# Altium project TRIQC.PrjPcb
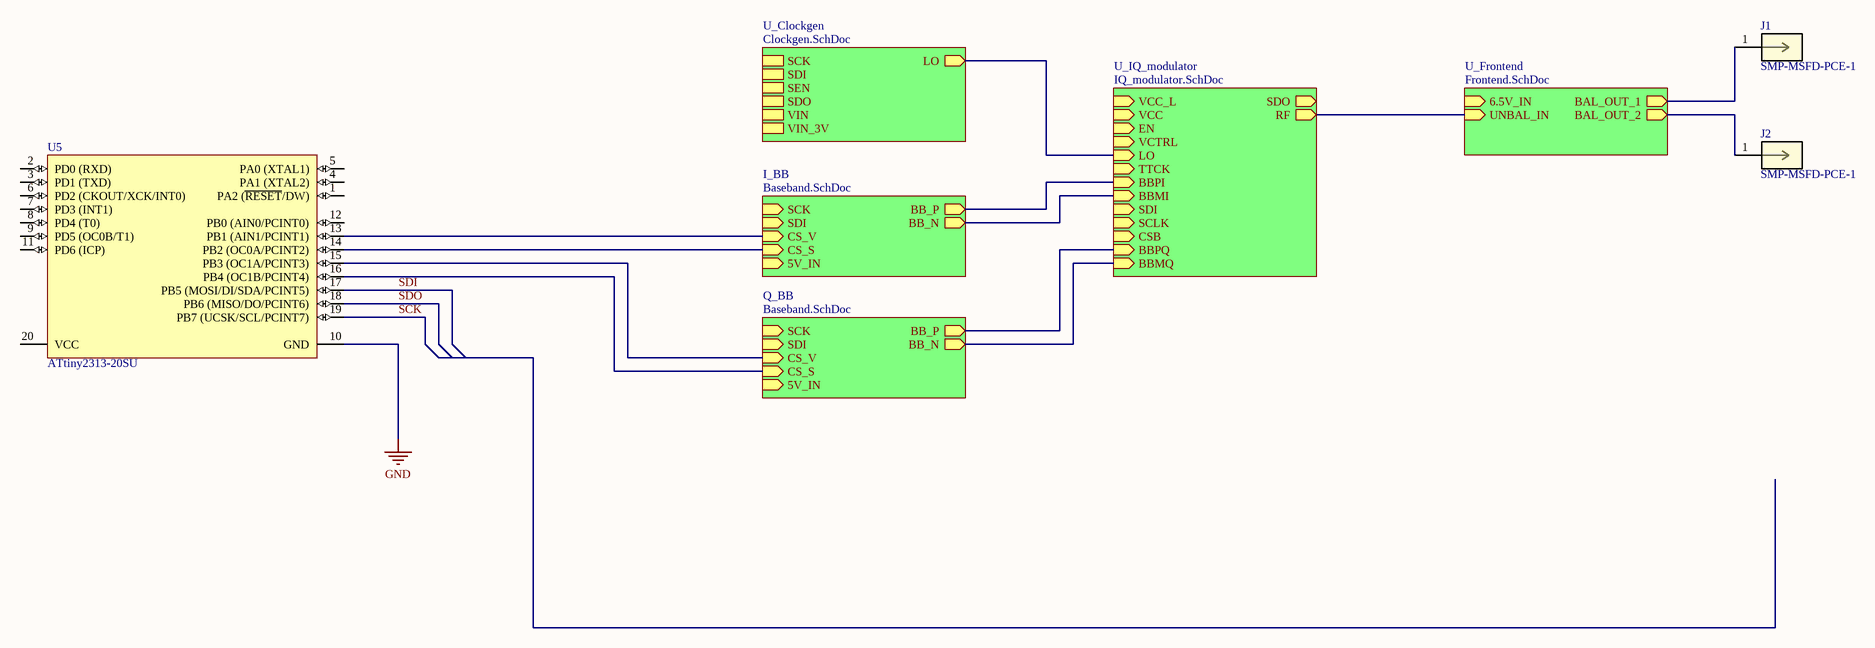
[diagram p0: Top_level.SchDoc]
5 sheets, 146 parts. Net scope: hierarchical (ports join the sheet entries above them; power ports are global).
Board file: TRIQC.PcbDoc
Sheets:
  Top_level.SchDoc
    U_Frontend = Frontend.SchDoc
    I_BB = Baseband.SchDoc
    Q_BB = Baseband.SchDoc
    U_Clockgen = Clockgen.SchDoc
    U_IQ_modulator = IQ_modulator.SchDoc

## Sheet Top_level.SchDoc
size C; SheetNumber: 1; SheetTotal: 5

### Parts
J1  SMP-MSFD-PCE-1  [CONN_SMP-MSFD-PCE-1_AMP]
J2  SMP-MSFD-PCE-1  [CONN_SMP-MSFD-PCE-1_AMP]
U5  ATtiny2313-20SU  [20S_L]

### Sub-sheets
I_BB = Baseband.SchDoc: SCK (in), SDI (in), CS_V (in), CS_S (in), 5V_IN (in), BB_P (out), BB_N (out)
Q_BB = Baseband.SchDoc: SCK (in), SDI (in), CS_V (in), CS_S (in), 5V_IN (in), BB_P (out), BB_N (out)
U_Clockgen = Clockgen.SchDoc: LO (out), SCK, SDI, SEN, SDO, VIN, VIN_3V
U_Frontend = Frontend.SchDoc: 6.5V_IN (in), BAL_OUT_1 (out), BAL_OUT_2 (out), UNBAL_IN (in)
U_IQ_modulator = IQ_modulator.SchDoc: VCC_L (in), VCC (in), EN (in), VCTRL (in), LO (in), TTCK (in), BBPI (in), BBMI (in), SDO (out), SDI (in), SCLK (in), CSB (in), RF (out), BBMQ (in), BBPQ (in)

### Nets
GND: U5.10(GND)
SCK: U5.19(PB7_(UCSK/SCL/PCINT7))
SDI: U5.17(PB5_(MOSI/DI/SDA/PCINT5))
SDO: U5.18(PB6_(MISO/DO/PCINT6))
NetC17_I_BB_1: sheet I_BB/BB_P, sheet U_IQ_modulator/BBPI
NetC17_I_BB_2: sheet I_BB/BB_N, sheet U_IQ_modulator/BBMI
NetC17_Q_BB_1: sheet Q_BB/BB_P, sheet U_IQ_modulator/BBPQ
NetC17_Q_BB_2: sheet Q_BB/BB_N, sheet U_IQ_modulator/BBMQ
NetC31_1: sheet U_Frontend/UNBAL_IN, sheet U_IQ_modulator/RF
NetC35_2: sheet U_Clockgen/LO, sheet U_IQ_modulator/LO
NetJ1_1: J1.1 ; sheet U_Frontend/BAL_OUT_1
NetJ2_1: J2.1 ; sheet U_Frontend/BAL_OUT_2
NetU5_13: U5.13(PB1_(AIN1/PCINT1)) ; sheet I_BB/CS_V
NetU5_14: U5.14(PB2_(OC0A/PCINT2)) ; sheet I_BB/CS_S
NetU5_15: U5.15(PB3_(OC1A/PCINT3)) ; sheet Q_BB/CS_V
NetU5_16: U5.16(PB4_(OC1B/PCINT4)) ; sheet Q_BB/CS_S

Not connected (* = marked no-connect by the designer): U5 1(PA2_(~{RESET}/DW)) 2(PD0_(RXD)) 3(PD1_(TXD)) 4(PA1_(XTAL2)) 5(PA0_(XTAL1)) 6(PD2_(CKOUT/XCK/INT0)) 7(PD3_(INT1)) 8(PD4_(T0)) 9(PD5_(OC0B/T1)) 11(PD6_(ICP)) 12(PB0_(AIN0/PCINT0)) 20(VCC)

### Library data of the parts
J1 J2 = SMP-MSFD-PCE-1: No Description Available; Mfr_Name: Amphenol ICC; Copyright: Copyright (C) 2023 Ultra Librarian. All rights reserved.; Manufacturer_Part_Number: SMP-MSFD-PCE-1; RefDes: RefDes; Type: DEV
U5 = CMP-0093-00143-2: Low Power tinyAVR® 8-Bit Microcontroller, 2.7-5.5V, 20MHz, 2K Flash Memory, Industrial Grade (-40°C to 85°C), 20-Lead SOIC, Pb-Free; DatasheetVersion: revL, Aug-2010; ComponentLink1Description: Manufacturer URL; ComponentLink3Description: ATtiny2313 Summary; Code_JEDEC: MS-013-AC; PackageDescription: 20-lead, 0.300" Wide Body, Plastic Gull Wing Small Outline Package (SOIC); RevisionNote: DatasheetVersion & PackageVersion updated. URLs added.; ComponentLink2URL: http://www.atmel.com/dyn/resources/prod_documents/doc2543.pdf; ComponentLink3URL: http://www.atmel.com/dyn/resources/prod_documents/doc2543S.pdf; Code_IPC: SOIC127P1030-20; ComponentLink2Description: ATtiny2313 Datasheet; PackageReference: 20S; ComponentLink1URL: http://www.atmel.com/; PackageVersion: revB, Nov-2006

## Sheet Frontend.SchDoc
size C; SheetNumber: 4; SheetTotal: 5
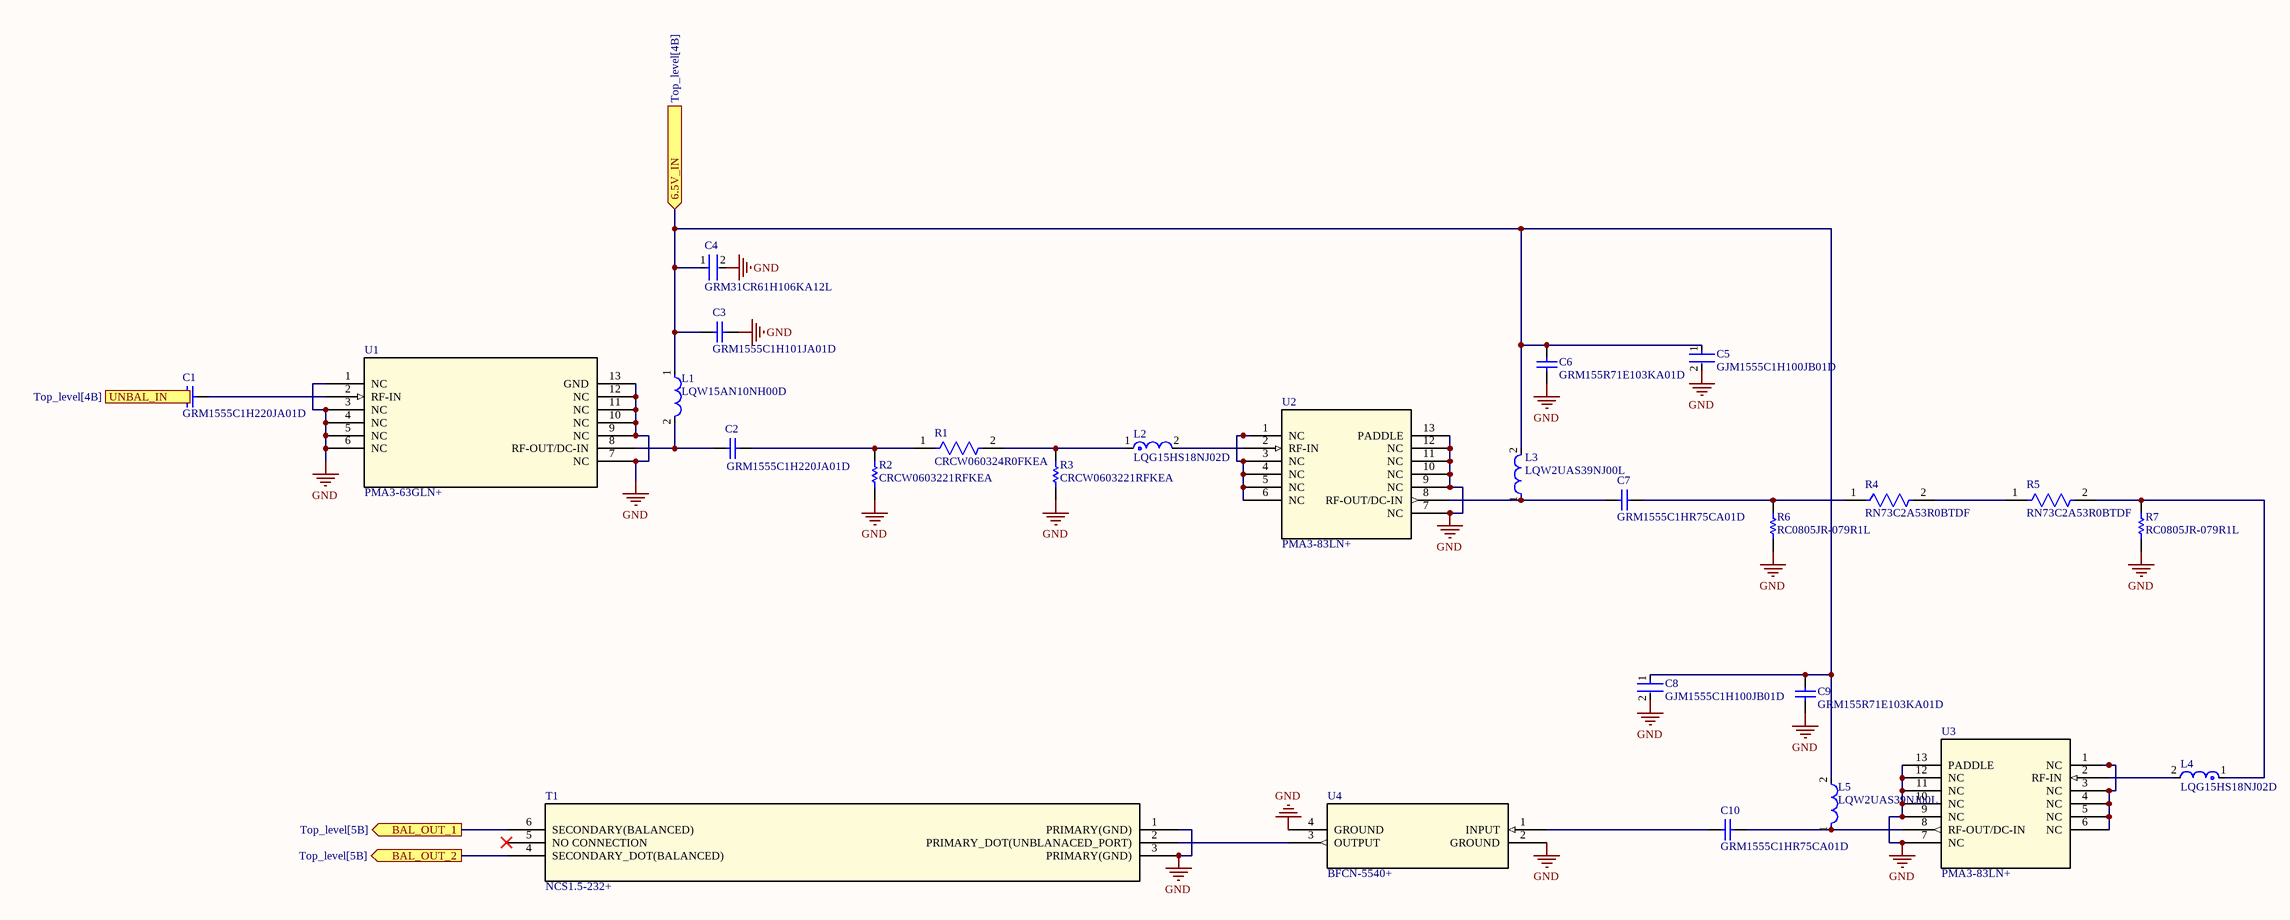
[diagram p1: Frontend.SchDoc]

### Parts
C1  GRM1555C1H220JA01D  [CAPC1005X55X25NL05T10]
C2  GRM1555C1H220JA01D  [CAPC1005X55X25NL05T10]
C3  GRM1555C1H101JA01D  [CAPC1005X55X25ML05T10]
C4  GRM31CR61H106KA12L  [FP-GRM31-0_2-MFG]
C5  GJM1555C1H100JB01D  [FP-GJM155-0_05-IPC_A]
C6  GRM155R71E103KA01D  [CAPC1005X55X25LL05T10]
C7  GRM1555C1HR75CA01D  [CAPC1005X55X25LL05T10]
C8  GJM1555C1H100JB01D  [FP-GJM155-0_05-IPC_A]
C9  GRM155R71E103KA01D  [CAPC1005X55X25LL05T10]
C10  GRM1555C1HR75CA01D  [CAPC1005X55X25LL05T10]
L1  LQW15AN10NH00D  [FP-LQW15AN_00-W0_6-0_1-MFG]
L2  LQG15HS18NJ02D  [FP-LQG15HH_02-MFG]
L3  LQW2UAS39NJ00L  [FP-LQW2UAS_00-MFG]
L4  LQG15HS18NJ02D  [FP-LQG15HH_02-MFG]
L5  LQW2UAS39NJ00L  [FP-LQW2UAS_00-MFG]
R1  CRCW060324R0FKEA  [FP-CRCW0603-e3-MFG]
R2  CRCW0603221RFKEA  [RESC1609X50X30LL10T20]
R3  CRCW0603221RFKEA  [RESC1609X50X30LL10T20]
R4  RN73C2A53R0BTDF  [FP-RN732A-MFG]
R5  RN73C2A53R0BTDF  [FP-RN732A-MFG]
R6  RC0805JR-079R1L  [RESC2013X60X35LL10T20]
R7  RC0805JR-079R1L  [RESC2013X60X35LL10T20]
T1  NCS1.5-232+  [GE0805C-9_MNC]
U1  PMA3-63GLN+  [DQ1225_MNC]
U2  PMA3-83LN+  [DQ1225_MNC]
U3  PMA3-83LN+  [DQ1225_MNC]
U4  BFCN-5540+  [FV1206-4_MNC]

### Ports
6.5V_IN (in, see Top_level[4B]), BAL_OUT_1 (out, see Top_level[5B]), BAL_OUT_2 (out, see Top_level[5B]), UNBAL_IN (in, see Top_level[4B])

### Nets
GND: C3.2 C4.2 C5.2 C6.1 C8.2 C9.1 R2.1 R3.1 R6.1 R7.1 T1.1(PRIMARY(GND)) T1.3(PRIMARY(GND)) U1.1(NC) U1.3(NC) U1.4(NC) U1.5(NC) U1.6(NC) U1.7(NC) U1.9(NC) U1.10(NC) U1.11(NC) U1.12(NC) U1.13(GND) U2.7(NC) U2.9(NC) U2.10(NC) U2.11(NC) U2.12(NC) U2.13(PADDLE) U3.7(NC) U3.9(NC) U3.10(NC) U3.11(NC) U3.12(NC) U3.13(PADDLE) U4.2(GROUND) U4.4(GROUND)
NetC1_1: C1.1 U1.2(RF-IN)
NetC2_1: C2.1 L1.2 U1.8(RF-OUT/DC-IN)
NetC2_2: C2.2 R1.1 R2.2
NetC3_1: C3.1 C4.1 C5.1 C6.2 C8.1 C9.2 L1.1 L3.2 L5.2 ; port 6.5V_IN
NetC7_1: C7.1 L3.1 U2.8(RF-OUT/DC-IN)
NetC7_2: C7.2 R4.1 R6.2
NetC10_1: C10.1 L5.1 U3.8(RF-OUT/DC-IN)
NetC10_2: C10.2 U4.1(INPUT)
NetJ1_1: T1.6(SECONDARY(BALANCED)) ; port BAL_OUT_1
NetJ2_1: T1.4(SECONDARY_DOT(BALANCED)) ; port BAL_OUT_2
NetL2_1: L2.1 R1.2 R3.2
NetL2_2: L2.2 U2.2(RF-IN)
NetL4_1: L4.1 R5.2 R7.2
NetL4_2: L4.2 U3.2(RF-IN)
NetR4_2: R4.2 R5.1
NetT1_2: T1.2(PRIMARY_DOT(UNBLANACED_PORT)) U4.3(OUTPUT)
NetU2_1: U2.1(NC) U2.3(NC) U2.4(NC) U2.5(NC) U2.6(NC)
NetU3_1: U3.1(NC) U3.3(NC) U3.4(NC) U3.5(NC) U3.6(NC)

Not connected (* = marked no-connect by the designer): C1 2; T1 5(NO_CONNECTION)*

### Library data of the parts
C1 C2 = CMP-2008-04302-1: Manufacturer: Murata; Part Number: GRM1555C1H220JA01D
C3 = CMP-2008-03915-1: Manufacturer: Murata; Part Number: GRM1555C1H101JA01D
C4 = CMP-2000-05256-2: CAP CER 10UF 50V X5R 1206; Manufacturer: Murata Electronics North America; Tolerance: 10%; Temperature Coefficient: 15%; Material: Ceramic; Height: 1.8mm; Temperature: -55°C to +85°C; Lead Free: Yes; Temperature Characteristic: X5R; ComponentLink2Description: Datasheet; Digikey Description: CAP CER 10UF 50V X5R 1206; Octopart: https://octopart.com/grm31cr61h106ka12l-murata-18903335; Device Class L2: Capacitors; Automotive: No; Value: 10uF; Temperature Range High: +85°C; Temperature Range Low: -55°C; Device Class L3: Ceramic Capacitors; Voltage Rating: 50V; Capacitance: 10uF; Device Class L1: Passive Components; Mouser Description: Multilayer Ceramic Capacitors MLCC - SMD/SMT 1206 10uF 50volt X5R +/-10%; ComponentLink2URL: https://search.murata.co.jp/Ceramy/image/img/A01X/G101/ENG/GRM31CR61H106KA12-01A.pdf; Manufacturer Part Number: GRM31CR61H106KA12L; Package: GRM31-0.2; RoHS: TRUE; Category: Cap
C5 C8 = CMP-2008-03797-2: Multi-Layer Ceramic Capacitor 10pF C0G  ±5% 0402 Paper T/R; Voltage Rating (DC): 50V; Mount: Surface Mount; Width: 0.02inch; Height: 0.5mm; Termination: SMD/SMT; Capacitance: 10pF; Packaging: Tape and Reel; Case Code (Metric): 1005; Depth: 0.5mm; Min Operating Temperature: -55°C; Case/Package: 0402; Voltage Rating: 50V; Tolerance: 5%; Lead Free: Lead Free; Package Quantity: 1; Case Code (Imperial): 0402; Radiation Hardening: No; Length: 1mm; Voltage: 50V; Dielectric: C0G; Thickness: 0.022inch; Max Operating Temperature: 125°C
C6 C9 = CMP-1034-01880-2: Manufacturer: Murata; Part Number: GRM155R71E103KA01D
C7 C10 = CMP-2008-04480-1: Manufacturer: Murata; Part Number: GRM1555C1HR75CA01D
L1 = CMP-06042-000413-1: Wire Wound RF Inductor 10nH ±3% 500mA 0.17Ω 0402 (1005); Q Factor: 25; Core Material: Non-Magnetic; Test Frequency: 100MHz; DC Resistance (DCR): 170mR; Self Resonant Frequency: 5.5GHz; Shielding: Unshielded; Current: 370mA; Inductance: 10nH; Case Code (Imperial): 0402; Package Quantity: 10000; Height: 0.5mm; Width: 0.02inch; Case Code (Metric): 1005; Tolerance: 3%; Min Operating Temperature: -55°C; Packaging: Tape and Reel; Length: 1mm; DC Current: 500mA; Current Rating: 500mA; Military Standard: Not; Max DC Current: 500mA; Case/Package: 0402; Lead Free: Lead Free; Radiation Hardening: No; Weight: 2.8E-05oz; Height - Seated (Max): 0.024inch; Depth: 0.7mm; Termination: SMD/SMT; Resistor Type: Wirewound; Max Operating Temperature: 125°C; Mount: Surface Mount
L2 L4 = CMP-06042-000668-1: Multilayer type RF Inductor 18nH ±5% 0.36Ω 400mA 0402; DC Current: 300mA; Test Frequency: 100MHz; Self Resonant Frequency: 2.2GHz; Shielding: Unshielded; Core Material: Air; DC Resistance (DCR): 360mR; Q Factor: 8; Inductance: 18nH; Military Standard: Not; REACH SVHC: No SVHC; Tolerance: 5%; Inductance Tolerance: 5%; Weight: 2.3E-05oz; Lead Free: Lead Free; Depth: 0.55mm; Current Rating: 300mA; Max DC Current: 300mA; Max Operating Temperature: 125°C; Length: 0.039inch; Min Operating Temperature: -55°C; Width: 0.5mm; Radiation Hardening: No; Termination: SMD/SMT; Height: 0.5mm; Package Quantity: 10000; Packaging: Tape and Reel; Case/Package: 0402; Case Code (Imperial): 0402; Mount: Surface Mount; Height - Seated (Max): 0.022inch; Case Code (Metric): 1005
L3 L5 = CMP-06042-008950-1: Wire Wound RF Inductor 39nH ±5% 1000mA 0.15Ω 1008 (2520); Q Factor: 60; Test Frequency: 50MHz; Max DC Current: 1A; Self Resonant Frequency: 1.5GHz; DC Resistance (DCR): 150mR; Core Material: Air; Shielding: Unshielded; Package Quantity: 1; Radiation Hardening: No; Weight: 0.001376oz; Case Code (Metric): 2520; Max Operating Temperature: 125°C; Case Code (Imperial): 1008; Inductance Tolerance: 5%; Current Rating: 1A; Resistor Type: Wirewound; Inductance: 39nH; Mount: Surface Mount; Width: 0.096inch; Min Operating Temperature: -55°C; Packaging: Tape and Reel; Length: 0.103inch; Case/Package: 1008; Termination: SMD/SMT; Height: 1.83mm; REACH SVHC: No SVHC; Depth: 2.65mm; Height - Seated (Max): 0.08inch; Tolerance: 5%
R1 = CMP-2000-03123-2: RES Thick Film, 24Ω, 1%, 0.1W, 100ppm/°C, 0603; Voltage Rating (DC): 75V; Power Rating: 100mW; Resistance: 24R; Case/Package: 0603; Composition: Thick Film; Temperature Coefficient: 100ppm/°C; Length: 1.55mm; Military Standard: Not; Tolerance: 1%; Height: 0.45mm; Width: 0.033inch; Case Code (Imperial): 0603; Weight: 7.1E-05oz; Depth: 0.85mm; Radiation Hardening: No; Packaging: Tape and Reel; Number of Terminations: 2; Case Code (Metric): 1608; Termination: SMD/SMT; Package Quantity: 10; Max Power Dissipation: 100mW; Min Operating Temperature: -55°C; Max Operating Temperature: 155°C; Contact Plating: Tin; Number of Pins: 2; Voltage Rating: 75V; Lead Free: Lead Free; Features: Automotive AEC-Q200
R2 R3 = CMP-2000-03090-1: Manufacturer: Vishay Dale; Part Number: CRCW0603221RFKEA
R4 R5 = CMP-03211-003837-1: SMD Chip Resistor, Thin Film, 53.0Ω, 100 V, 0805 [2012 Metric], 100 mW, 0.1%, RN73 Series; Manufacturer: TE Connectivity; Power Rating: 0.1W; Temperature Coefficient: 10ppm/°C; Voltage Rating: 100V; Ipc Land Pattern Name: RESC200125X55; Device Class L2: Resistors; Lead Free: Yes; Octopart: https://octopart.com/rn73c2a53r0btdf-te+connectivity-22742106; Resistance: 53.0Ω; Temperature: -55°C to 155°C; Package: RN732A; Height: 0.65mm; Temperature Range Low: -55°C; Device Class L3: Chip SMD Resistors; octopart_url: https://octopart.com/rn73c2a53r0btdf-te+connectivity-22742106; Automotive: No; RoHS: TRUE; Device Class L1: Passive Components; packaging: 1000 Reel; Value: 53.0Ω; ComponentLink2URL: https://www.te.com/commerce/DocumentDelivery/DDEController?Action=showdoc&DocId=Data+Sheet%7F1773270%7FP%7Fpdf%7FEnglish%7FENG_DS_1773270_P.pdf%7F1676162-2; ComponentLink2Description: Datasheet; Series: RN73; Manufacturer Part Number: RN73C2A53R0BTDF; Temperature Range High: 155°C; Category: Res; Composition: Thin Film; Tolerance: 0.1%
R6 R7 = CMP-2001-01410-1: Manufacturer: Yageo; Part Number: RC0805JR-079R1L
T1 = NCS1.5-232+: No Description Available; Mfr_Name: Mini Circuits; Type: DEV; Copyright: Copyright (C) 2023 Ultra Librarian. All rights reserved.; Manufacturer_Part_Number: NCS1.5-232+; RefDes: RefDes
U1 = PMA3-63GLN+: No Description Available; Mfr_Name: Mini Circuits; Copyright: Copyright (C) 2023 Ultra Librarian. All rights reserved.; Manufacturer_Part_Number: PMA3-63GLN+; RefDes: RefDes; Type: DEV
U2 U3 = PMA3-83LN+: No Description Available; Mfr_Name: Mini Circuits; Copyright: Copyright (C) 2023 Ultra Librarian. All rights reserved.; Manufacturer_Part_Number: PMA3-83LN+; RefDes: RefDes; Type: DEV
U4 = BFCN-5540+: No Description Available; Mfr_Name: Mini Circuits; Copyright: Copyright (C) 2023 Ultra Librarian. All rights reserved.; Manufacturer_Part_Number: BFCN-5540+; RefDes: RefDes; Type: DEV

## Sheet Baseband.SchDoc
size B; SheetNumber: 2; SheetTotal: 5
Used 2 times, as channels I_BB, Q_BB. Parts and nets are listed once, with the designators drawn on the sheet.
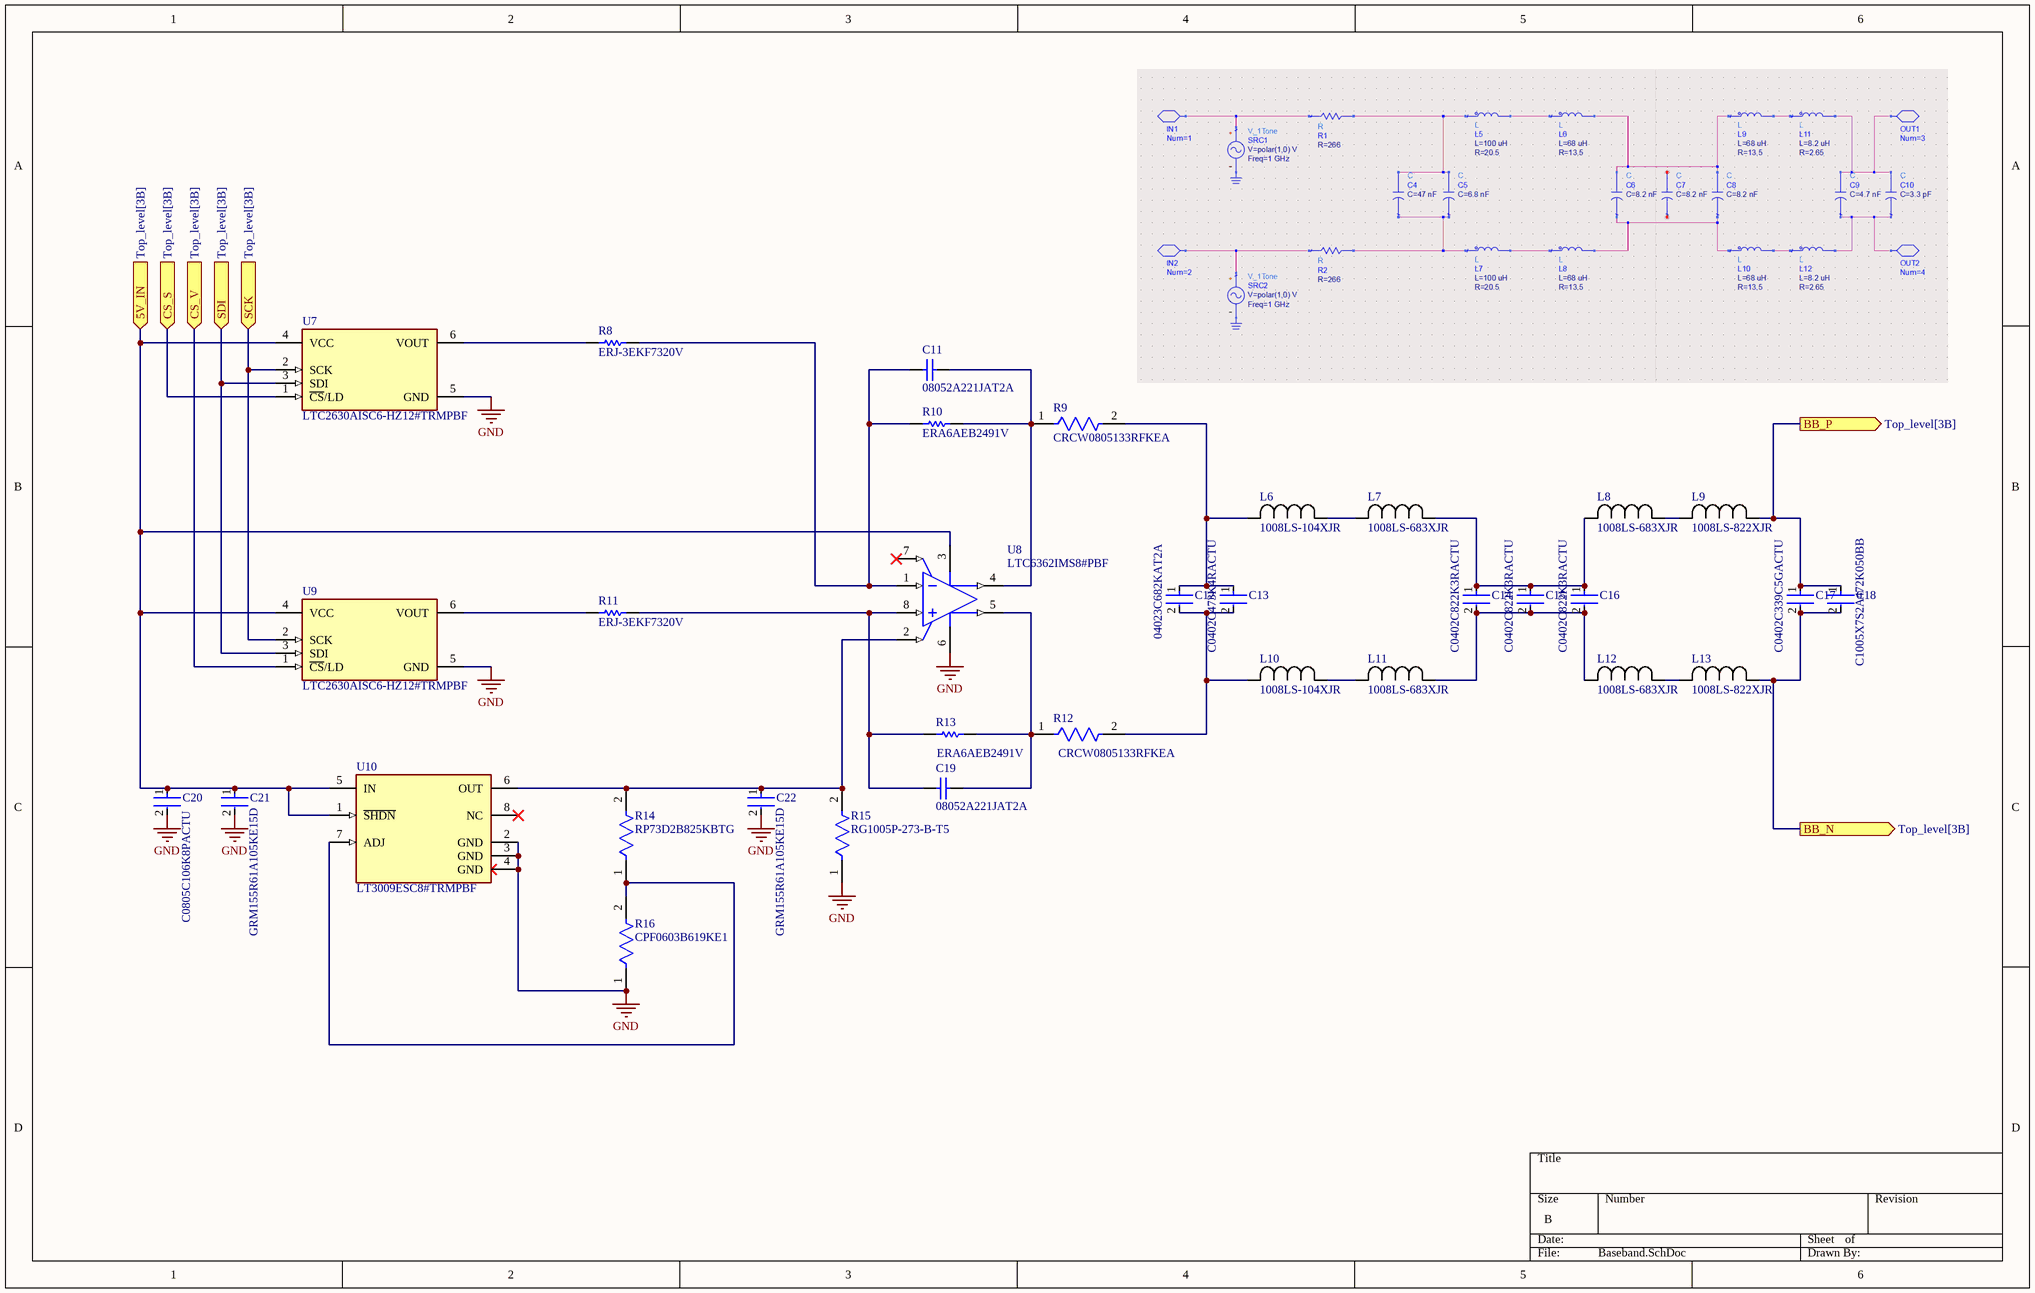
[diagram p2: Baseband.SchDoc]

### Parts
C11  08052A221JAT2A  [CAPC2013X140X50LL20T25]
C12  04023C682KAT2A  [FP-0402-L_1_0_1-W_0_5_0_1-IPC_A]
C13  C0402C473K4RACTU  [FP-C0402-BB-MFG]
C14  C0402C822K3RACTU  [FP-C0402-BB-MFG]
C15  C0402C822K3RACTU  [FP-C0402-BB-MFG]
C16  C0402C822K3RACTU  [FP-C0402-BB-MFG]
C17  C1005X7S2A472K050BB  [FP-C1005-050-0_05-IPC_C]
C18  C0402C339C5GACTU  [FP-C0402-BB-MFG]
C19  08052A221JAT2A  [CAPC2013X140X50LL20T25]
C20  C0805C106K8PACTU  [FP-C0805C-DG-MFG]
C21  GRM155R61A105KE15D  [FP-GRM15-0_1-MFG]
C22  GRM155R61A105KE15D  [FP-GRM15-0_1-MFG]
L6  1008LS-104XJR  [IND_1008LS]
L7  1008LS-683XJR  [IND_1008LS]
L8  1008LS-683XJR  [IND_1008LS]
L9  1008LS-822XJR  [IND_1008LS]
L10  1008LS-104XJR  [IND_1008LS]
L11  1008LS-683XJR  [IND_1008LS]
L12  1008LS-683XJR  [IND_1008LS]
L13  1008LS-822XJR  [IND_1008LS]
R8  ERJ-3EKF7320V  [RESC1608X55X30LL15T15]
R9  CRCW0805133RFKEA  [FP-CRCW0805-e3-IPC_C]
R10  ERA6AEB2491V  [RESC2013X60X40LL20T25]
R11  ERJ-3EKF7320V  [RESC1608X55X30LL15T15]
R12  CRCW0805133RFKEA  [FP-CRCW0805-e3-IPC_C]
R13  ERA6AEB2491V  [RESC2013X60X40LL20T25]
R14  RP73D2B825KBTG  [FP-RP732B-MFG]
R15  RG1005P-273-B-T5  [FP-RG1005-IPC_B]
R16  CPF0603B619KE1  [FP-CPF0603-MFG]
U7  LTC2630AISC6-HZ12#TRMPBF  [FP-SC6-6-05-08-1638-IPC_A]
U8  LTC6362IMS8#PBF  [LT-MS8-8_L]
U9  LTC2630AISC6-HZ12#TRMPBF  [FP-SC6-6-05-08-1638-IPC_A]
U10  LT3009ESC8#TRMPBF  [FP-SC8-8-05-08-1639-MFG]

### Ports
5V_IN (in, see Top_level[3B]), BB_N (out, see Top_level[3B]), BB_P (out, see Top_level[3B]), CS_S (in, see Top_level[3B]), CS_V (in, see Top_level[3B]), SCK (in, see Top_level[3B]), SDI (in, see Top_level[3B])

### Nets
GND: C20.2 C21.2 C22.2 R15.1 R16.1 U7.5(GND) U8.6(V-) U9.5(GND) U10.2(GND) U10.3(GND) U10.4(GND)
5V_IN: C20.1 C21.1 U7.4(VCC) U8.3(V+) U9.4(VCC) U10.1(~{SHDN}) U10.5(IN) ; port 5V_IN
BB_N: C17.2 C18.2 L13.1 ; port BB_N
BB_P: C17.1 C18.1 L9.1 ; port BB_P
CS_S: U7.1(~{CS}/LD) ; port CS_S
CS_V: U9.1(~{CS}/LD) ; port CS_V
SCK: U7.2(SCK) U9.2(SCK) ; port SCK
SDI: U7.3(SDI) U9.3(SDI) ; port SDI
NetC11_1: C11.1 R8.2 R10.1 U8.1(-IN)
NetC11_2: C11.2 R9.1 R10.2 U8.4(+OUT)
NetC12_1: C12.1 C13.1 L6.2 R9.2
NetC12_2: C12.2 C13.2 L10.2 R12.2
NetC14_1: C14.1 C15.1 C16.1 L7.1 L8.2
NetC14_2: C14.2 C15.2 C16.2 L11.1 L12.2
NetC19_1: C19.1 R11.2 R13.1 U8.8(+IN)
NetC19_2: C19.2 R12.1 R13.2 U8.5(-OUT)
NetC22_1: C22.1 R14.2 R15.2 U8.2(VOCM) U10.6(OUT)
NetL6_1: L6.1 L7.2
NetL8_1: L8.1 L9.2
NetL10_1: L10.1 L11.2
NetL12_1: L12.1 L13.2
NetR8_1: R8.1 U7.6(VOUT)
NetR11_1: R11.1 U9.6(VOUT)
NetR14_1: R14.1 R16.2 U10.7(ADJ)

Not connected (* = marked no-connect by the designer): U8 7(~{SHDN})*; U10 8(NC)*

### Channels
I_BB: designators end in _I_BB; ports 5V_IN=NetC20_I_BB_1 BB_N=NetC17_I_BB_2 BB_P=NetC17_I_BB_1 CS_S=NetU5_14 CS_V=NetU5_13 SCK=NetU7_I_BB_2 SDI=NetU7_I_BB_3
Q_BB: designators end in _Q_BB; ports 5V_IN=NetC20_Q_BB_1 BB_N=NetC17_Q_BB_2 BB_P=NetC17_Q_BB_1 CS_S=NetU5_16 CS_V=NetU5_15 SCK=NetU7_Q_BB_2 SDI=NetU7_Q_BB_3

### Library data of the parts
C11 C19 = CMP-2007-04587-1: Manufacturer: AVX Interconnect / Elco; Part Number: 08052A221JAT2A
C12 = CMP-2008-02545-2: General Purpose Ceramic Capacitor, 0402, 6.8nF, 10%, X7R, 15%, 25V; Height: 0.56mm; RoHS Compliant: Yes; Case Code (Metric): 1005; Lead Free: Lead Free; Width: 0.5mm; Weight: 2.3E-05oz; Series: -; Package Quantity: 1; Case Code (Imperial): 0402; Min Operating Temperature: -55°C; Max Operating Temperature: 125°C; Depth: 0.5mm; Tolerance: 10%; Voltage Rating (DC): 25V; Voltage: 25V; Packaging: Tape and Reel; REACH SVHC: No SVHC; Mount: Surface Mount; Case/Package: 0402; Thickness: 0.022inch; Dielectric: X7R; Termination: SMD/SMT; Number of Pins: 2; Construction: Flat; Radiation Hardening: No; Length: 1mm; Capacitance: 6.8nF; Voltage Rating: 25V
C13 = CMP-2008-03221-2: Cap Ceramic 0.047uF 16V X7R 10% SMD 0402 125°C Paper T/R; Manufacturer: Kemet; Tolerance: 0.1; Value: 47,000 pF; Temperature Coefficient: 15%; Material: Ceramic; Mouser Description: Multilayer Ceramic Capacitors MLCC - SMD/SMT 16volts 47000pF X7R 10%; ComponentLink2Description: Datasheet; Temperature Characteristic: X7R; Automotive: No; Package: C0402-BB; Height: 0.55mm; Manufacturer Part Number: C0402C473K4RACTU; Ipc Land Pattern Name: CAPC10050X50; Temperature: -55°C to +125°C; ComponentLink2URL: https://content.kemet.com/datasheets/KEM_C1002_X7R_SMD.pdf; RoHS: TRUE; Capacitance: 47,000 pF; Temperature Range High: +125°C; Digikey Description: Cap Ceramic 0.047uF 16V X7R 10% SMD 0402 125°C Paper T/R; Octopart: https://octopart.com/c0402c473k4ractu-kemet-145703; Lead Free: Yes; Device Class L2: Capacitors; Voltage Rating: 16 V; Temperature Range Low: -55°C; Device Class L1: Passive Components; Category: Cap; Device Class L3: Ceramic Capacitors
C14-C16 = CMP-2008-03260-2: CAP CER 8200PF 25V X7R 0402; Manufacturer: Kemet; Tolerance: 0.1; Capacitance: 8,200 pF; Material: Ceramic; Temperature Coefficient: 15%; Value: 8,200 pF; Lead Free: Yes; Device Class L3: Ceramic Capacitors; Digikey Description: CAP CER 8200PF 25V X7R 0402; Temperature Characteristic: X7R; Automotive: No; Temperature Range Low: -55°C; Manufacturer Part Number: C0402C822K3RACTU; Device Class L2: Capacitors; ComponentLink2Description: Datasheet; Temperature Range High: +125°C; Voltage Rating: 25 V; Device Class L1: Passive Components; Ipc Land Pattern Name: CAPC10050X50; Temperature: -55°C to +125°C; RoHS: TRUE; Package: C0402-BB; ComponentLink2URL: https://content.kemet.com/datasheets/KEM_C1002_X7R_SMD.pdf; Mouser Description: Multilayer Ceramic Capacitors MLCC - SMD/SMT 25volts 8200pF X7R 10%; Category: Cap; Octopart: https://octopart.com/c0402c822k3ractu-kemet-140357; Height: 0.55mm
C17 = CMP-08246-003235-1: Multilayer Ceramic Capacitors 4.7nF ±10% 100V X7S SMD 0402; Case Code (Imperial): 0402; RoHS Compliant: Yes; Capacitance: 4.7nF; Min Operating Temperature: -55°C; Voltage Rating (DC): 100V; Thickness: 0.022inch; Case Code (Metric): 1005; Height: 0.5mm; Tolerance: 10%; Termination: SMD/SMT; Width: 0.02inch; Voltage Rating: 100V; Dielectric: X7S; Case/Package: 0402; Resistor Type: Ceramic; Max Operating Temperature: 125°C; Mount: Surface Mount; Packaging: Tape and Reel; Length: 1mm; Package Quantity: 1; Weight: 2.3E-05oz; Series: C; Lead Free: Lead Free; Depth: 0.5mm
C18 = CMP-2008-03312-2: Capacitor: ceramic; MLCC; 3.3pF; 50VDC; C0G; ±0.25pF; SMD; 0402; Manufacturer: Kemet; Temperature Coefficient: 15%; Voltage Rating: 50 V; RoHS: TRUE; Material: Ceramic; Capacitance: 3.3 pF; Value: 3.3 pF; Height: 0.55mm; Manufacturer Part Number: C0402C339C5GACTU; Temperature: -55°C to +125°C; Package: C0402-BB; Mouser Description: Multilayer Ceramic Capacitors MLCC - SMD/SMT 50volts 3.3pF C0G .25pF; Category: Cap; ComponentLink2Description: Datasheet; Device Class L1: Passive Components; Tolerance: 0.25 pF; Temperature Characteristic: C0G; ComponentLink2URL: https://content.kemet.com/datasheets/KEM_C1002_X7R_SMD.pdf; Device Class L2: Capacitors; Temperature Range High: +125°C; Digikey Description: Capacitor: ceramic; MLCC; 3.3pF; 50VDC; C0G; ±0.25pF; SMD; 0402; Lead Free: Yes; Ipc Land Pattern Name: CAPC10050X50; Octopart: https://octopart.com/c0402c339c5gactu-kemet-105751; Automotive: No; Device Class L3: Ceramic Capacitors; Temperature Range Low: -55°C
C20 = CMP-2007-03243-2: CAP CER 10UF 10V X5R 0805; Manufacturer: Kemet; 3DS Part Number: 220-00001; Tolerance: 10%; Temperature Coefficient: 15%; Material: Ceramic; Device Class L2: Capacitors; Device Class L1: Passive Components; ComponentLink2URL: https://content.kemet.com/datasheets/KEM_C1006_X5R_SMD.pdf; Height: 1.4mm; Lead Free: Yes; Manufacturer Part Number: C0805C106K8PACTU; Digikey Description: CAP CER 10UF 10V X5R 0805; Octopart: https://octopart.com/c0805c106k8pactu-kemet-98697; Capacitance: 10uF; Value: 10uF; Temperature Range Low: -55°C; Temperature: -55°C to +85°C; Automotive: No; Mouser Description: CAP CER 10UF 10V X5R 0805; Ipc Land Pattern Name: CAPC200125X125; Temperature Range High: +85°C; Voltage: 10V; RoHS: TRUE; Device Class L3: Ceramic Capacitors; ComponentLink2Description: Datasheet; Voltage Rating: 10V; Package: C0805C-DG; Temperature Characteristic: X5R; Category: Cap
C21 C22 = CMP-2008-04556-2: CAP CER 1UF 10V X5R 0402; Manufacturer: Murata; Material: Ceramic; Tolerance: 10%; Temperature Coefficient: 15%; Octopart: https://octopart.com/grm155r61a105ke15d-murata-197442; Manufacturer Part Number: GRM155R61A105KE15D; Lead Free: Yes; ComponentLink2Description: Datasheet; Temperature: -55°C to +85°C; Temperature Range High: +85°C; Height: 0.55mm; Capacitance: 1uF; Ipc Land Pattern Name: CAPC10050X50; ComponentLink2URL: https://search.murata.co.jp/Ceramy/image/img/A01X/G101/ENG/GRM155R61A105KE15-01A.pdf; Temperature Range Low: -55°C; Device Class L2: Capacitors; Voltage Rating: 10V; RoHS: TRUE; Device Class L1: Passive Components; Device Class L3: Ceramic Capacitors; Temperature Characteristic: X5R; Mouser Description: 0402 1 uF 10 V ±10% Tolerance X5R Surface Mount Multilayer Ceramic Capacitor; Automotive: No; Package: GRM15-0.1; Digikey Description: CAP CER 1UF 10V X5R 0402; Value: 1uF; Category: Cap
L6-L13 = 1008LS-152XJLC: No Description Available; Mfr_Name: Coilcraft; Type: DEV; Copyright: Copyright (C) 2023 Ultra Librarian. All rights reserved.; Manufacturer_Part_Number: 1008LS-152XJLC; RefDes: RefDes
R8 R11 = CMP-2000-00632-1: Manufacturer: Panasonic; Part Number: ERJ-3EKF7320V
R9 R12 = CMP-1013-00410-3: RES Thick Film, 133Ω, 1%, 0.125W, 100ppm/°C, 0805; Voltage Rating: 150V; Max Power Dissipation: 125mW; Resistance: 133R; Width: 0.049inch; Length: 2mm; Termination: SMD/SMT; Package Quantity: 10; Depth: 1.25mm; Height: 0.45mm; Voltage Rating (DC): 150V; Number of Terminations: 2; Temperature Coefficient: 100ppm/°C; Lead Free: Lead Free; Min Operating Temperature: -55°C; Contact Plating: Tin; Features: Automotive AEC-Q200; Packaging: Tape and Reel; Max Operating Temperature: 155°C; Case/Package: 0805; Weight: 0.000194oz; Tolerance: 1%; Radiation Hardening: No; Power Rating: 125mW; Case Code (Metric): 2012; Composition: Thick Film; Case Code (Imperial): 0805
R10 R13 = CMP-2001-00781-1: Manufacturer: Panasonic; Part Number: ERA6AEB2491V
R14 = CMP-03211-008746-1: Res Thin Film 1206 825KΩ 0.1% 0.25W 15ppm/°C Molded SMD; Manufacturer: TE Connectivity; Voltage Rating: 200V; Temperature: -55°C to 155°C; Height: 0.65mm; packaging: 250 cut tape length; Temperature Range Low: -55°C; Package: RP732B; Temperature Range High: 155°C; Temperature Coefficient: 15ppm/°C; ComponentLink2URL: https://www.te.com/commerce/DocumentDelivery/DDEController?Action=showdoc&DocId=Data+Sheet%7F1773272%7FL%7Fpdf%7FEnglish%7FENG_DS_1773272_L.pdf%7F8-1879255-6; Tolerance: 0.1%; Resistance: 825KΩ; Octopart: https://octopart.com/rp73d2b825kbtg-te+connectivity-42012325; Automotive: No; Ipc Land Pattern Name: RESC305155X55; Device Class L2: Resistors; Power Rating: 0.25W; Category: Res; Manufacturer Part Number: RP73D2B825KBTG; octopart_url: https://octopart.com/rp73d2b825kbtg-te+connectivity-42012325; Device Class L1: Passive Components; Composition: Thin Film; RoHS: TRUE; Value: 825KΩ; Device Class L3: Chip SMD Resistors; Lead Free: Yes; ComponentLink2Description: Datasheet; Series: RP73
R15 = CMP-2002-01241-2: Automotive Metal Thin Film Chip Resistor, 0402, 27kΩ, 0.1%, 25ppm/°C, 0.0625W, 75V; Max Power Dissipation: 63mW; Voltage Rating: 25V; Power Rating: 30mW; Resistance: 27kR; Case Code (Imperial): 0402; Resistor Type: Thin Film; Length: 0.039inch; Tolerance: 0.1%; Packaging: Tape and Reel; Resistance Tolerance: 0.1%; Width: 0.02inch; Termination: SMD/SMT; Series: RG; Voltage Rating (DC): 25V; Temperature Coefficient: 25ppm/°C; RoHS Compliant: Yes; Height: 0.016inch; Number of Terminations: 2; Max Operating Temperature: 155°C; Package Quantity: 1; Features: Automotive AEC-Q200; Number of Pins: 2; Case/Package: 0402; Min Operating Temperature: -55°C; Lead Free: Lead Free; Case Code (Metric): 1005
R16 = CMP-03211-010478-1: RES SMD 619KΩ 0.1% 1/16W 0603; Manufacturer: TE Connectivity; Voltage Rating: 50V; Power Rating: 0.063W; Temperature Coefficient: 25ppm/°C; ComponentLink2Description: Datasheet; Category: Res; Temperature: -55°C to +155°C; Height: 0.55mm; octopart_url: https://octopart.com/cpf0603b619ke1-te+connectivity-76349732; Tolerance: 0.1%; Device Class L3: Chip SMD Resistors; Manufacturer Part Number: CPF0603B619KE1; Octopart: https://octopart.com/cpf0603b619ke1-te+connectivity-76349732; Device Class L1: Passive Components; Series: CPF; Temperature Range Low: -55°C; ComponentLink2URL: https://www.te.com/commerce/DocumentDelivery/DDEController?Action=showdoc&DocId=Data+Sheet%7F1773200%7FM%7Fpdf%7FEnglish%7FENG_DS_1773200_M.pdf%7F3-1676481-2; Automotive: No; packaging: 1k Reel; Package: CPF0603; Value: 619KΩ; Device Class L2: Resistors; Lead Free: Yes; Temperature Range High: +155°C; RoHS: TRUE; Ipc Land Pattern Name: RESC15580X45; Composition: Thin Film; Resistance: 619KΩ
U7 U9 = CMP-09082-000043-1: IC DAC 12BIT V-OUT SC70-6; Min Supply Voltage: 4.5V; Interface: SPI; Output Type: Voltage; Integral Nonlinearity (INL): 1LSB; Max Supply Voltage: 5.5V; Resolution: 12b; Number of Bits: 12; Operating Supply Voltage: 5V; Supply Type: Single; Number of Channels: 1; Settling Time: 4.4us; Min Operating Temperature: -40°C; Case/Package: SC; Package Quantity: 500; Packaging: Tape and Reel; Max Operating Temperature: 85°C; Mount: Surface Mount; Number of Pins: 6; RoHS Compliant: Yes; Number of Converters: 1
U8 = CMP-0359-00855-2: Single Channel, Precision, Low Power Differential Operational Amplifier / SAR ADC Driver, RRIO, 180 MHz Typical GBW, 45 V/us Typical SR, 2.8 to 5.25 V, 8-Pin SOP (MS8-8), Industrial, Pb-Free; Manufacturer: Linear Technology; Channels (#): 1; Vs Max (V): 5.25; Vos (mV) Typical: 0.05; GBW (MHz) Typical: 180; Is (mA) Typical: 0.9; SR (V/us) Typical: 45; Vs Min (V): 2.8; Type: DIFF; PackageReference: LT-MS8-8; ComponentLink1Description: Manufacturer URL; Mounting Technology: Surface Mount; PackageVersion: Rev G; RevisionNote: URLs updated; PartNumber: LTC6362IMS8#PBF; Linear Technology Part Number: LTC6362; ComponentLink3URL: http://cds.linear.com/docs/en/packaging/05081610_G_SO8.pdf; ComponentLink2URL: http://cds.linear.com/docs/en/datasheet/6362fa.pdf; ComponentLink2Description: Datasheet; PackageDescription: 8-Lead Plastic Small Outline, Body 3.9 x 4.9 mm, Pitch 1.27 mm; DatasheetVersion: Rev. A; RoHS: Pb-Free; ComponentLink3Description: Package Specification; ComponentLink1URL: http://www.linear.com/
U10 = CMP-0476-01730-2: IC REG LIN POS ADJ 20MA SC70-8; Number of Regulators: 1; Max Output Voltage: 19.5V; Output Voltage Accuracy: 2%; Power Supply Rejection Ratio (PSRR): 72dB; Min Current Limit: 22mA; Dropout Voltage: 280mV; Operating Supply Current: 3uA; Polarity: Positive; Max Input Voltage: 20V; Reference Voltage: 600mV; Min Input Voltage: 1.6V; Quiescent Current: 6uA; Output Type: Adjustable; Width: 1.35mm; Accuracy: 2%; Height: 1mm; Output Voltage: 19.5V; Min Operating Temperature: -40°C; Output Current: 20mA; Case/Package: SC; Max Operating Temperature: 125°C; Max Output Current: 20mA; Number of Outputs: 1; Series: -; RoHS Compliant: Yes; Min Output Voltage: 600mV; Package Quantity: 1; Number of Pins: 8; Length: 2.2mm; Packaging: Tape and Reel

## Sheet Clockgen.SchDoc
size C; SheetNumber: 5; SheetTotal: 5
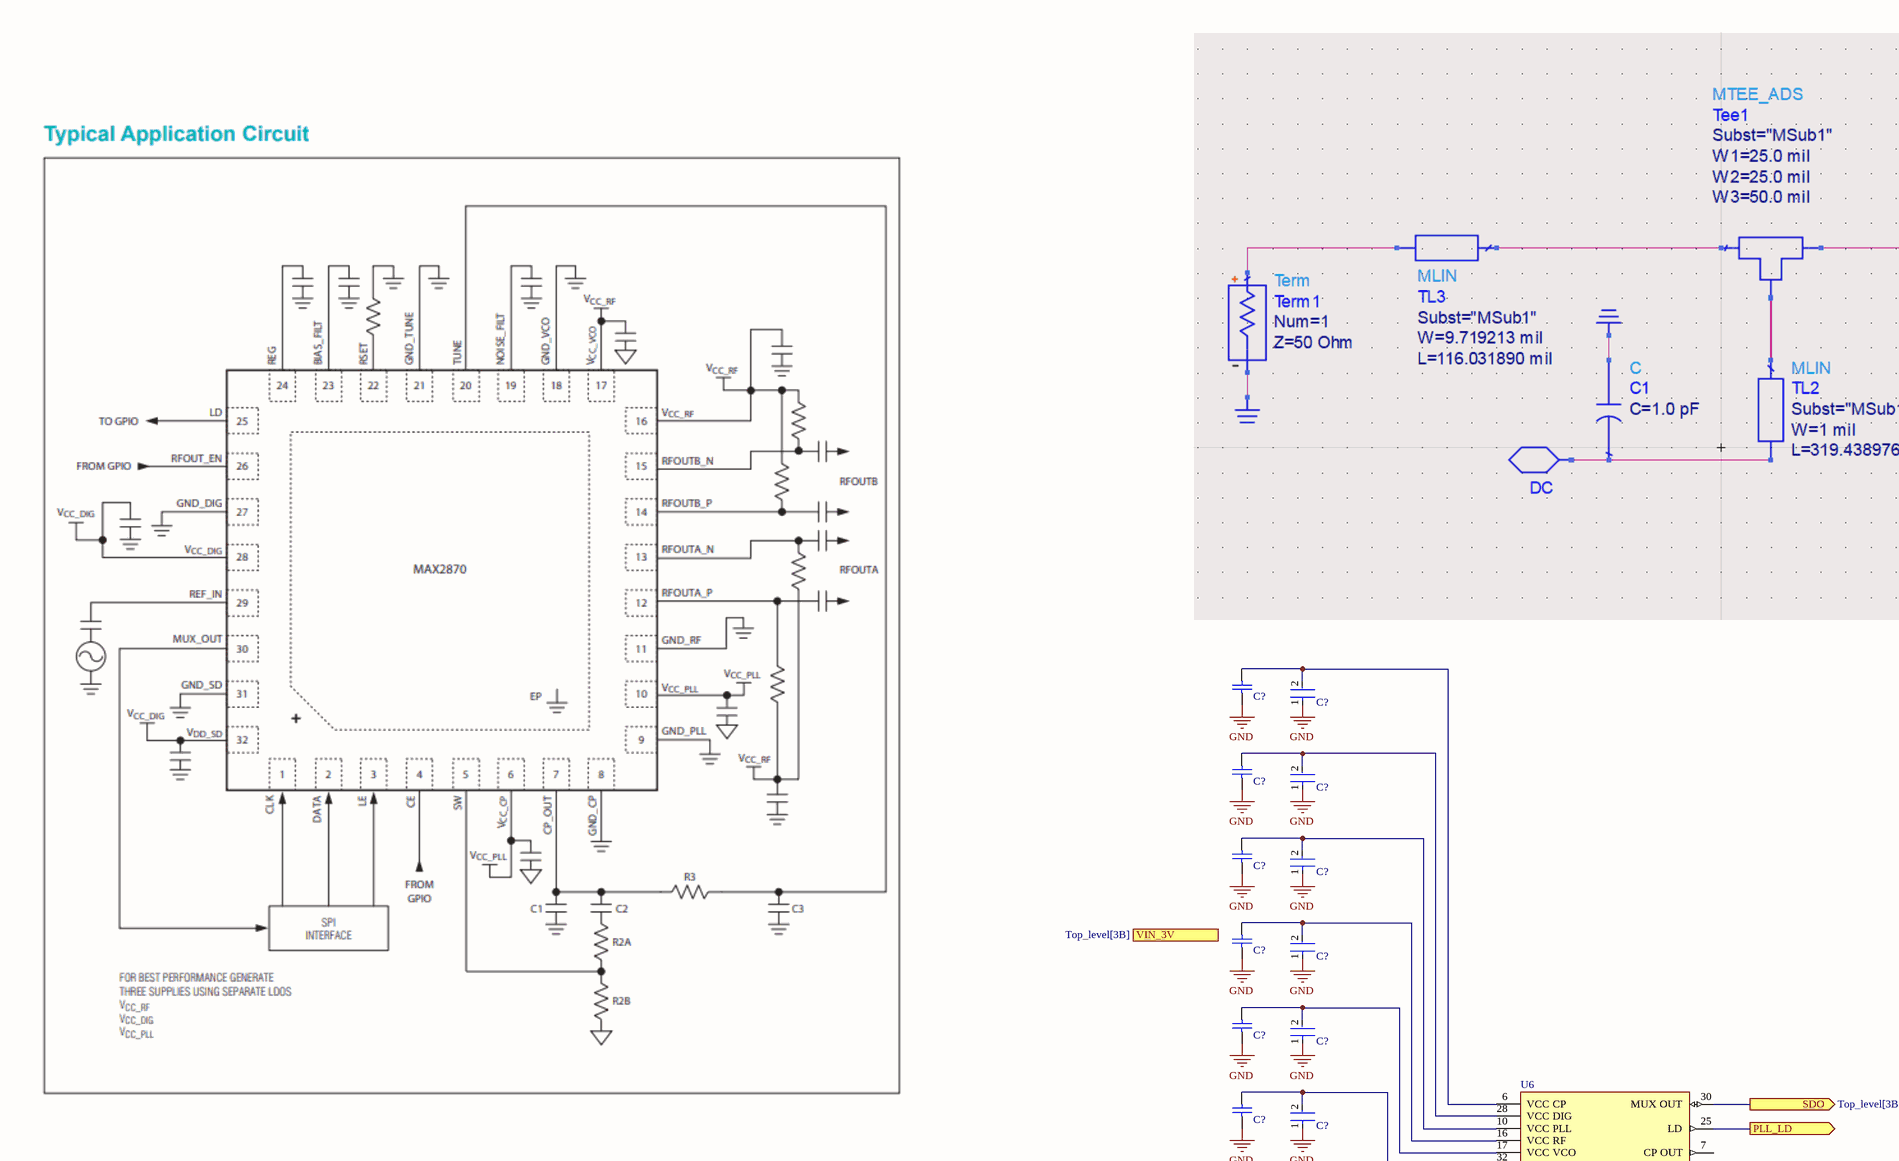
[diagram p3: Clockgen.SchDoc, top left]
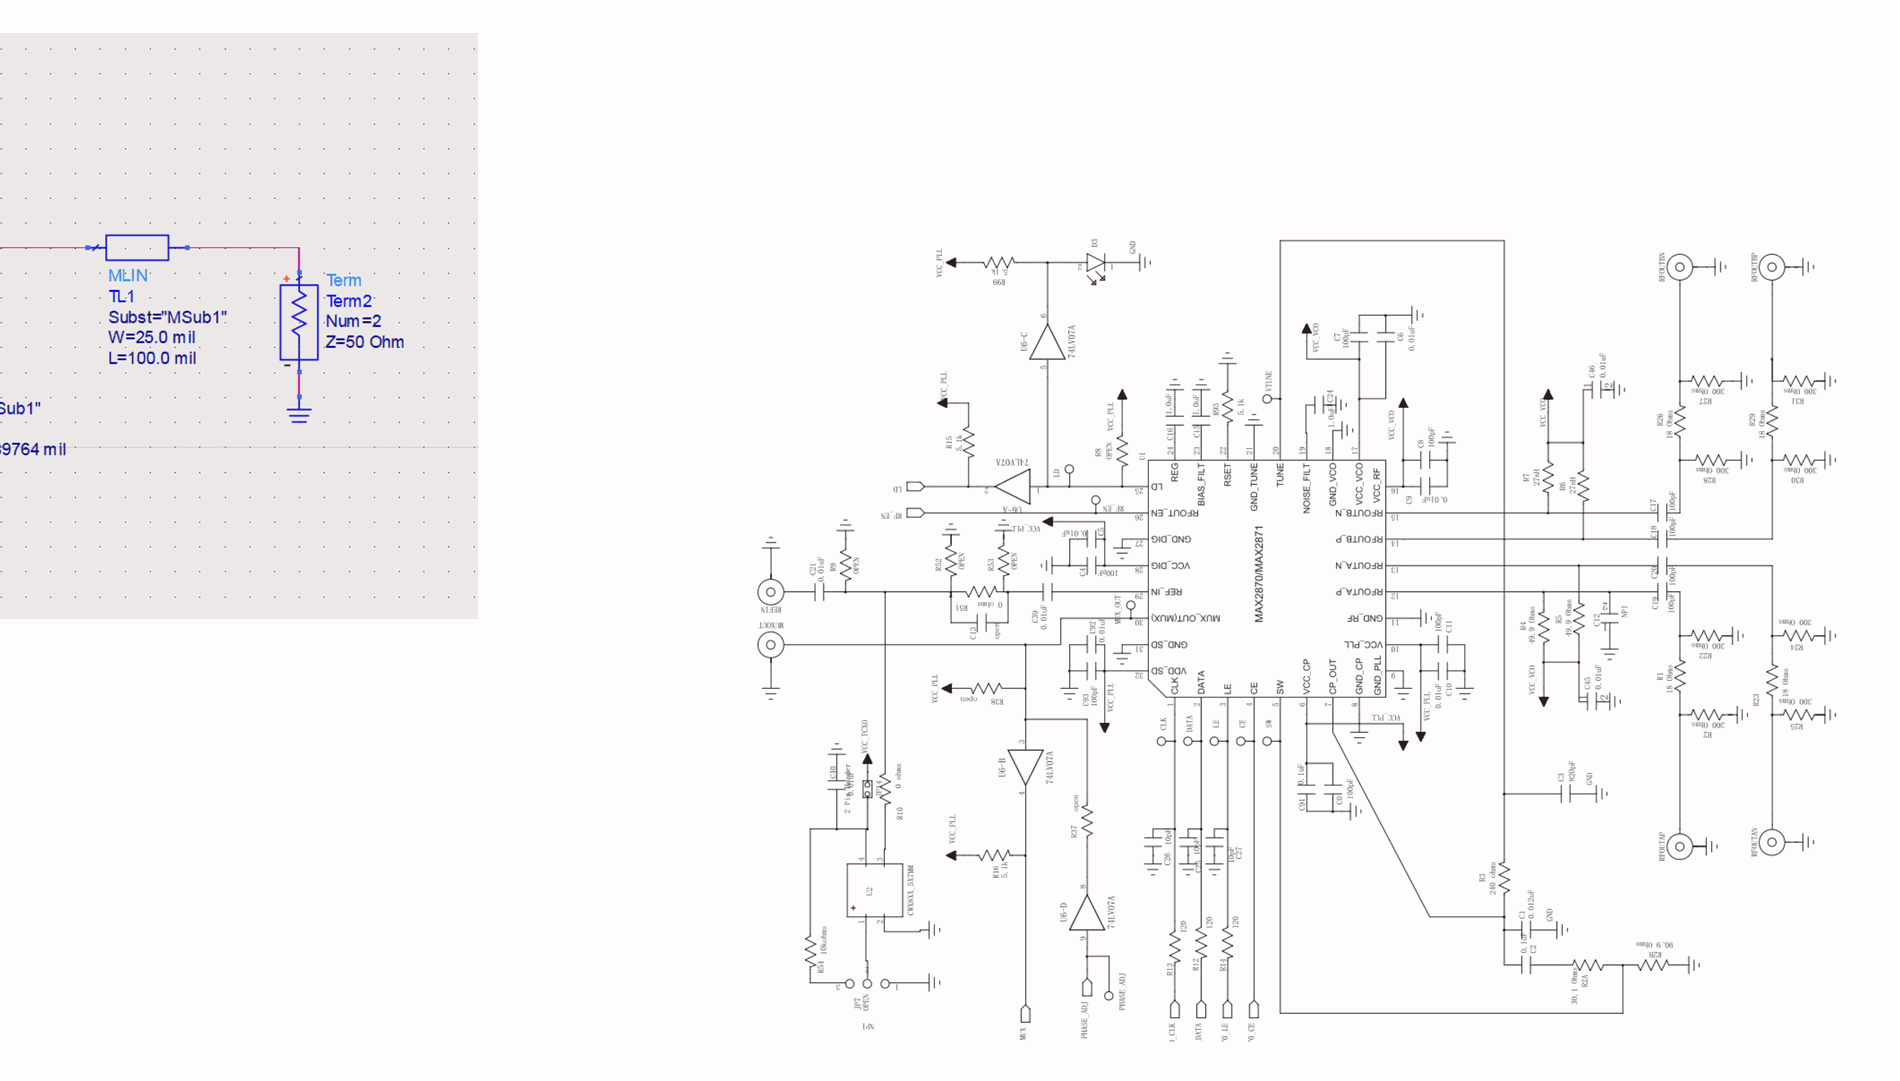
[diagram p4: Clockgen.SchDoc, top right]
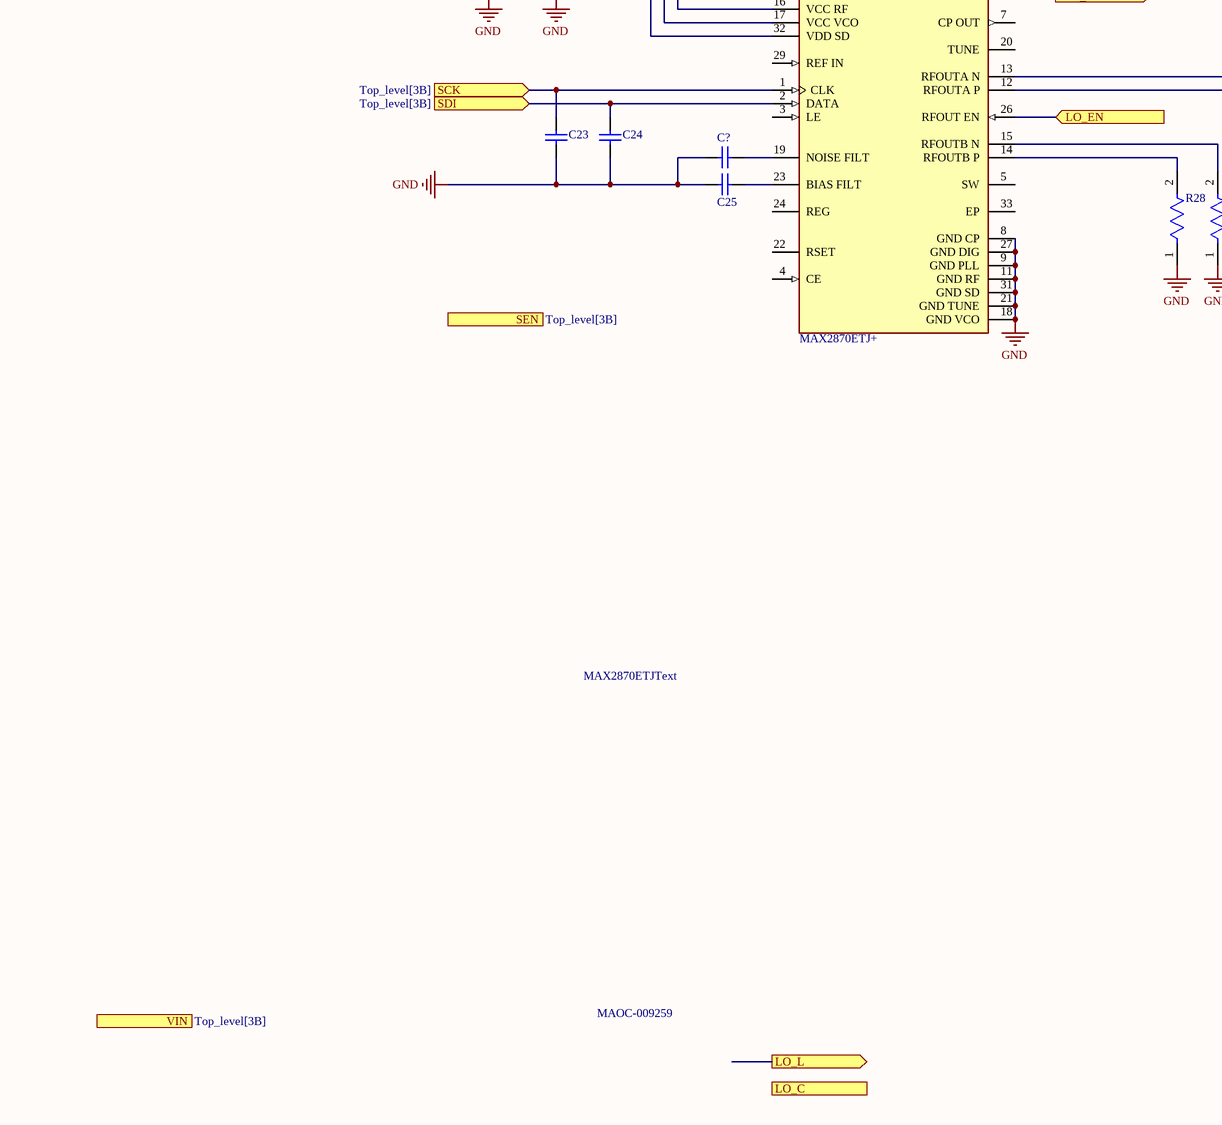
[diagram p5: Clockgen.SchDoc, bottom left]
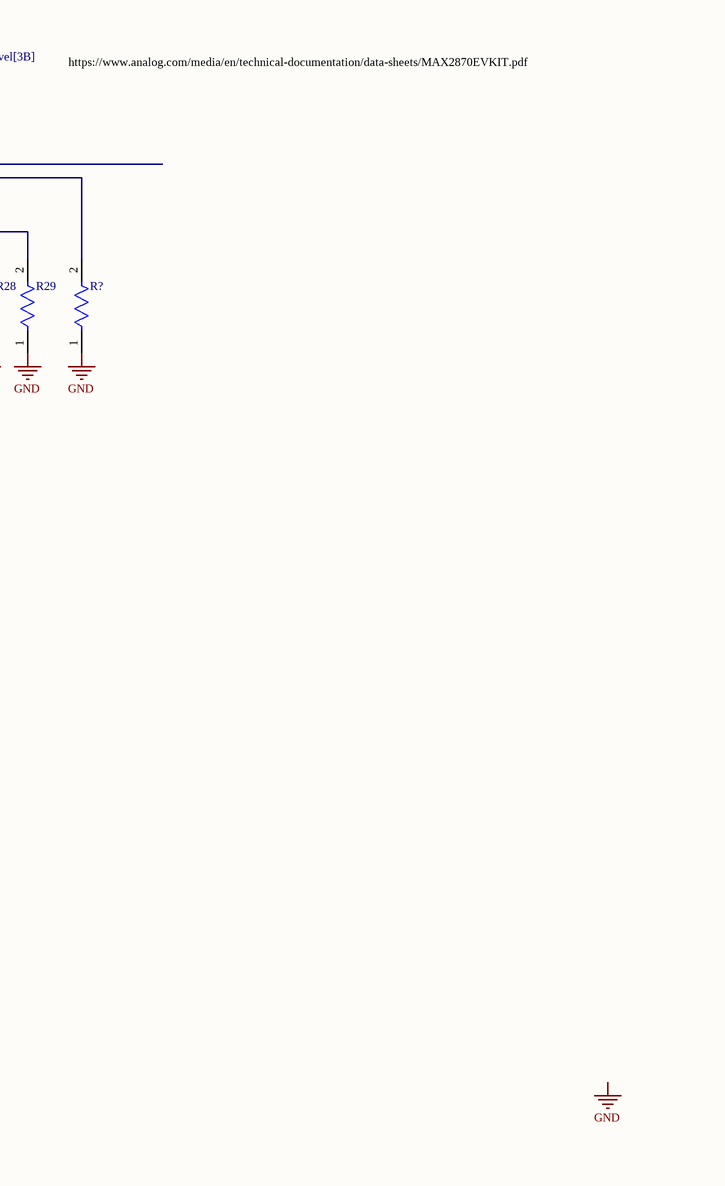
[diagram p6: Clockgen.SchDoc, bottom right]

### Parts
(Parts that share a designator on the sheet are numbered #1, #2 ... from top to bottom, then left to right.)
C23  GRM1885C1H100JA01D  [CAPC1608X90X35LL10T15]  (value not drawn)
C24  GRM1885C1H100JA01D  [CAPC1608X90X35LL10T15]  (value not drawn)
C25  C0805C105K4PACTU  [CAPC2013X145X50LL20T25]  (value not drawn)
C?#1  CC0603JRNPO9BN101  [CAPC1608X90X40ML10T20]  (value not drawn)
C?#2  C0603C103M4RACAUTO  [FP-C0603C-CF-MFG]  (value not drawn)
C?#3  CC0603JRNPO9BN101  [CAPC1608X90X40ML10T20]  (value not drawn)
C?#4  C0603C103M4RACAUTO  [FP-C0603C-CF-MFG]  (value not drawn)
C?#5  CC0603JRNPO9BN101  [CAPC1608X90X40ML10T20]  (value not drawn)
C?#6  C0603C103M4RACAUTO  [FP-C0603C-CF-MFG]  (value not drawn)
C?#7  CC0603JRNPO9BN101  [CAPC1608X90X40ML10T20]  (value not drawn)
C?#8  C0603C103M4RACAUTO  [FP-C0603C-CF-MFG]  (value not drawn)
C?#9  CC0603JRNPO9BN101  [CAPC1608X90X40ML10T20]  (value not drawn)
C?#10  C0603C103M4RACAUTO  [FP-C0603C-CF-MFG]  (value not drawn)
C?#11  CC0603JRNPO9BN101  [CAPC1608X90X40ML10T20]  (value not drawn)
C?#12  C0603C103M4RACAUTO  [FP-C0603C-CF-MFG]  (value not drawn)
C?#13  C0603C105K4RACTU  [CAPC1608X90X35LL15T15]  (value not drawn)
R28  CRCW060350R0FKEA  [FP-CRCW0603-e3-MFG]  (value not drawn)
R29  CRCW060350R0FKEA  [FP-CRCW0603-e3-MFG]  (value not drawn)
R?  CRCW060350R0FKEA  [FP-CRCW0603-e3-MFG]  (value not drawn)
U6  MAX2870ETJ+  [FP-T3255-5-MFG]

### Ports
LO_C (out), LO_EN (in), LO_L (out), PLL_LD (out), SCK (in, see Top_level[3B]), SDI (in, see Top_level[3B]), SDO (out, see Top_level[3B]), SEN (in, see Top_level[3B]), VIN (see Top_level[3B]), VIN_3V (see Top_level[3B])

### Nets
GND: C23.1 C24.1 C25.1 C?#1.1 C?#2.1 C?#3.1 C?#4.1 C?#5.1 C?#6.1 C?#7.1 C?#8.1 C?#9.1 C?#10.1 C?#11.1 C?#12.1 C?#13.1 R28.1 R29.1 R?.1 U6.8(GND_CP) U6.9(GND_PLL) U6.11(GND_RF) U6.18(GND_VCO) U6.21(GND_TUNE) U6.27(GND_DIG) U6.31(GND_SD)
NetC23_2: C23.2 U6.1(CLK) ; port SCK
NetC24_2: C24.2 U6.2(DATA) ; port SDI
NetC25_2: C25.2 U6.23(BIAS_FILT)
NetC?#1_2: C?#1.2 C?#2.2 U6.6(VCC_CP)
NetC?#3_2: C?#3.2 C?#4.2 U6.28(VCC_DIG)
NetC?#5_2: C?#5.2 C?#6.2 U6.10(VCC_PLL)
NetC?#7_2: C?#7.2 C?#8.2 U6.16(VCC_RF)
NetC?#9_2: C?#9.2 C?#10.2 U6.17(VCC_VCO)
NetC?#11_2: C?#11.2 C?#12.2 U6.32(VDD_SD)
NetC?#13_2: C?#13.2 U6.19(NOISE_FILT)
NetR28_2: R28.2 U6.14(RFOUTB_P)
NetR29_2: R29.2 U6.15(RFOUTB_N)
NetR?_2: R?.2 U6.12(RFOUTA_P)
NetU6_25: U6.25(LD) ; port PLL_LD
NetU6_26: U6.26(RFOUT_EN) ; port LO_EN
NetU6_30: U6.30(MUX_OUT) ; port SDO

Not connected (* = marked no-connect by the designer): U6 3(LE) 4(CE) 5(SW) 7(CP_OUT) 13(RFOUTA_N) 20(TUNE) 22(RSET) 24(REG) 29(REF_IN) 33(EP)

### Notes on the sheet
- https://www.analog.com/media/en/technical-documentation/data-sheets/MAX2870EVKIT.pdf
- MAX2870ETJText
- MAOC-009259
- Labels drawn without touching a wire or pin: GND

### Library data of the parts
C23 C24 = CMP-2006-02592-1: Manufacturer: Murata; Part Number: GRM1885C1H100JA01D
C25 = CMP-1036-04746-2: Manufacturer: Kemet; Part Number: C0805C105K4PACTU
C?#1 C?#3 C?#5 C?#7 C?#9 C?#11 = CMP-2100-03594-1: Chip Capacitor, 100 pF, +/- 5%, 50 V, -55 to 125 degC, 0603 (1608 Metric), RoHS, Tape and Reel; Manufacturer: Yageo; Capacitance: 100pF; Voltage Rating (DC): 50V; Dielectric: C0G; Temperature Coefficient: 30ppm/degC; Insulation Resistance: 100GR; Datasheet Version: Rev. 14, 07/2016; Manufacturer URL: http://www.yageo.com/; Packaging: TapeandReel; Mount: SurfaceMount; RoHSCompliant: True; Package Reference: 0603; Tolerance: 5%; Max Operating Temperature: 125degC; Case Code (Imperial): 0603; Number of Pins: 2; Width: 0.8mm; Case Code (Metric): 1608; Voltage: 50V; REACH SVHC: Unknown; Package Description: 2-Pin Surface Mount Device, Body 1.6 x 0.8 mm; Composition: Ceramic; Lead Free: LeadFree; Min Operating Temperature: -55degC; Radiation Hardening: No; Depth: 0.8mm; Thickness: 0.035inch; Datasheet URL: http://www.yageo.com/documents/recent/UPY-GP_NP0_16V-to-50V_14.pdf; Termination: SMD/SMT; Package Quantity: 1; Length: 1.6mm; Voltage Rating: 50V; Height: 0.8mm; Case/Package: 0603
C?#2 C?#4 C?#6 C?#8 C?#10 C?#12 = CMP-03020-020209-2: CAP CER 0603 .01UF 16V X7R 20% A; Manufacturer: KEMET; Capacitance: 10,000 pF; Temperature Coefficient: 30ppm/°C; Automotive Grade: Grade 1; Material: Ceramic; Tolerance: 0.2; Value: 10,000 pF; Temperature Characteristic: X7R; RoHS: TRUE; ComponentLink2Description: Datasheet; Category: Cap; Digikey Description: CAP CER 0603 .01UF 16V X7R 20% A; Lead Free: Yes; Temperature Range Low: -55°C; Height: 0.87mm; Temperature Range High: +125°C; Octopart: https://octopart.com/c0603c103m4racauto-kemet-75357849; Voltage Rating: 16 V; ComponentLink2URL: https://api.kemet.com/component-edge/download/datasheet/C0603C100J5GACAUTO.pdf; Package: C0603C-CF; Manufacturer Part Number: C0603C103M4RACAUTO; Automotive: Yes; Device Class L1: Passive Components; Device Class L2: Capacitors; Temperature: -55°C to +125°C; Device Class L3: Ceramic Capacitors
C?#13 = CMP-2006-02298-2: Manufacturer: Kemet; Part Number: C0603C105K4RACTU
R28 R29 R? = CMP-2000-03436-2: RES Thick Film, 50Ω, 1%, 0.1W, 100ppm/°C, 0603; Voltage Rating (DC): 75V; Resistance: 50R; Power Rating: 100mW; Case/Package: 0603; Packaging: Tape and Reel; Military Standard: Not; REACH SVHC: No SVHC; Width: 0.85mm; Max Operating Temperature: 155°C; Case Code (Metric): 1608; Temperature Coefficient: 100ppm/°C; Lead Free: Lead Free; Height: 0.45mm; Composition: Thick Film; Termination: SMD/SMT; Contact Plating: Tin; Number of Pins: 2; Tolerance: 1%; Depth: 0.85mm; Weight: 7.1E-05oz; Min Operating Temperature: -55°C; Length: 1.55mm; Radiation Hardening: No; Voltage Rating: 75V; Case Code (Imperial): 0603; Package Quantity: 5000; Mount: Surface Mount
U6 = CMP-05660-000001-1: RF FRACT INTR N SYNTH VCO 32TQFN; Manufacturer: Maxim Integrated; Nominal Supply Current: 10-144mA; Max Supply Voltage: 3.6V; Max Junction Temp: +150°C; Max Frequency: 6000MHz; Interface: SPI; Min Supply Voltage: 3V; Pll: YES; Number Of Outputs: 2; Standoff Height: 0mm; Ipc Land Pattern Name: QFN50P500X500X75-32; Manufacturer Part Number: MAX2870ETJ+; Height: 0.8mm; Device Class L1: Integrated Circuits (ICs); Temperature Range High: +85°C; Temperature Range Low: -40°C; Package: T3255-5; Temperature: -40°C to +85°C; Device Class L2: Clock and Timing; Category: IC; Device Class L3: PLLs; ComponentLink2Description: Datasheet; Automotive: No; Octopart: https://octopart.com/max2870etj%2B-maxim+integrated-21136837; Mouser Description: Phase Locked Loops - PLL PLL/VCO; ComponentLink2URL: https://datasheets.maximintegrated.com/en/ds/MAX2870.pdf; RoHS: TRUE; Footprint Url: https://pdfserv.maximintegrated.com/land_patterns/90-0013.PDF; Lead Free: Yes; Digikey Description: RF FRACT INTR N SYNTH VCO 32TQFN

## Sheet IQ_modulator.SchDoc
size B; SheetNumber: 2; SheetTotal: 5
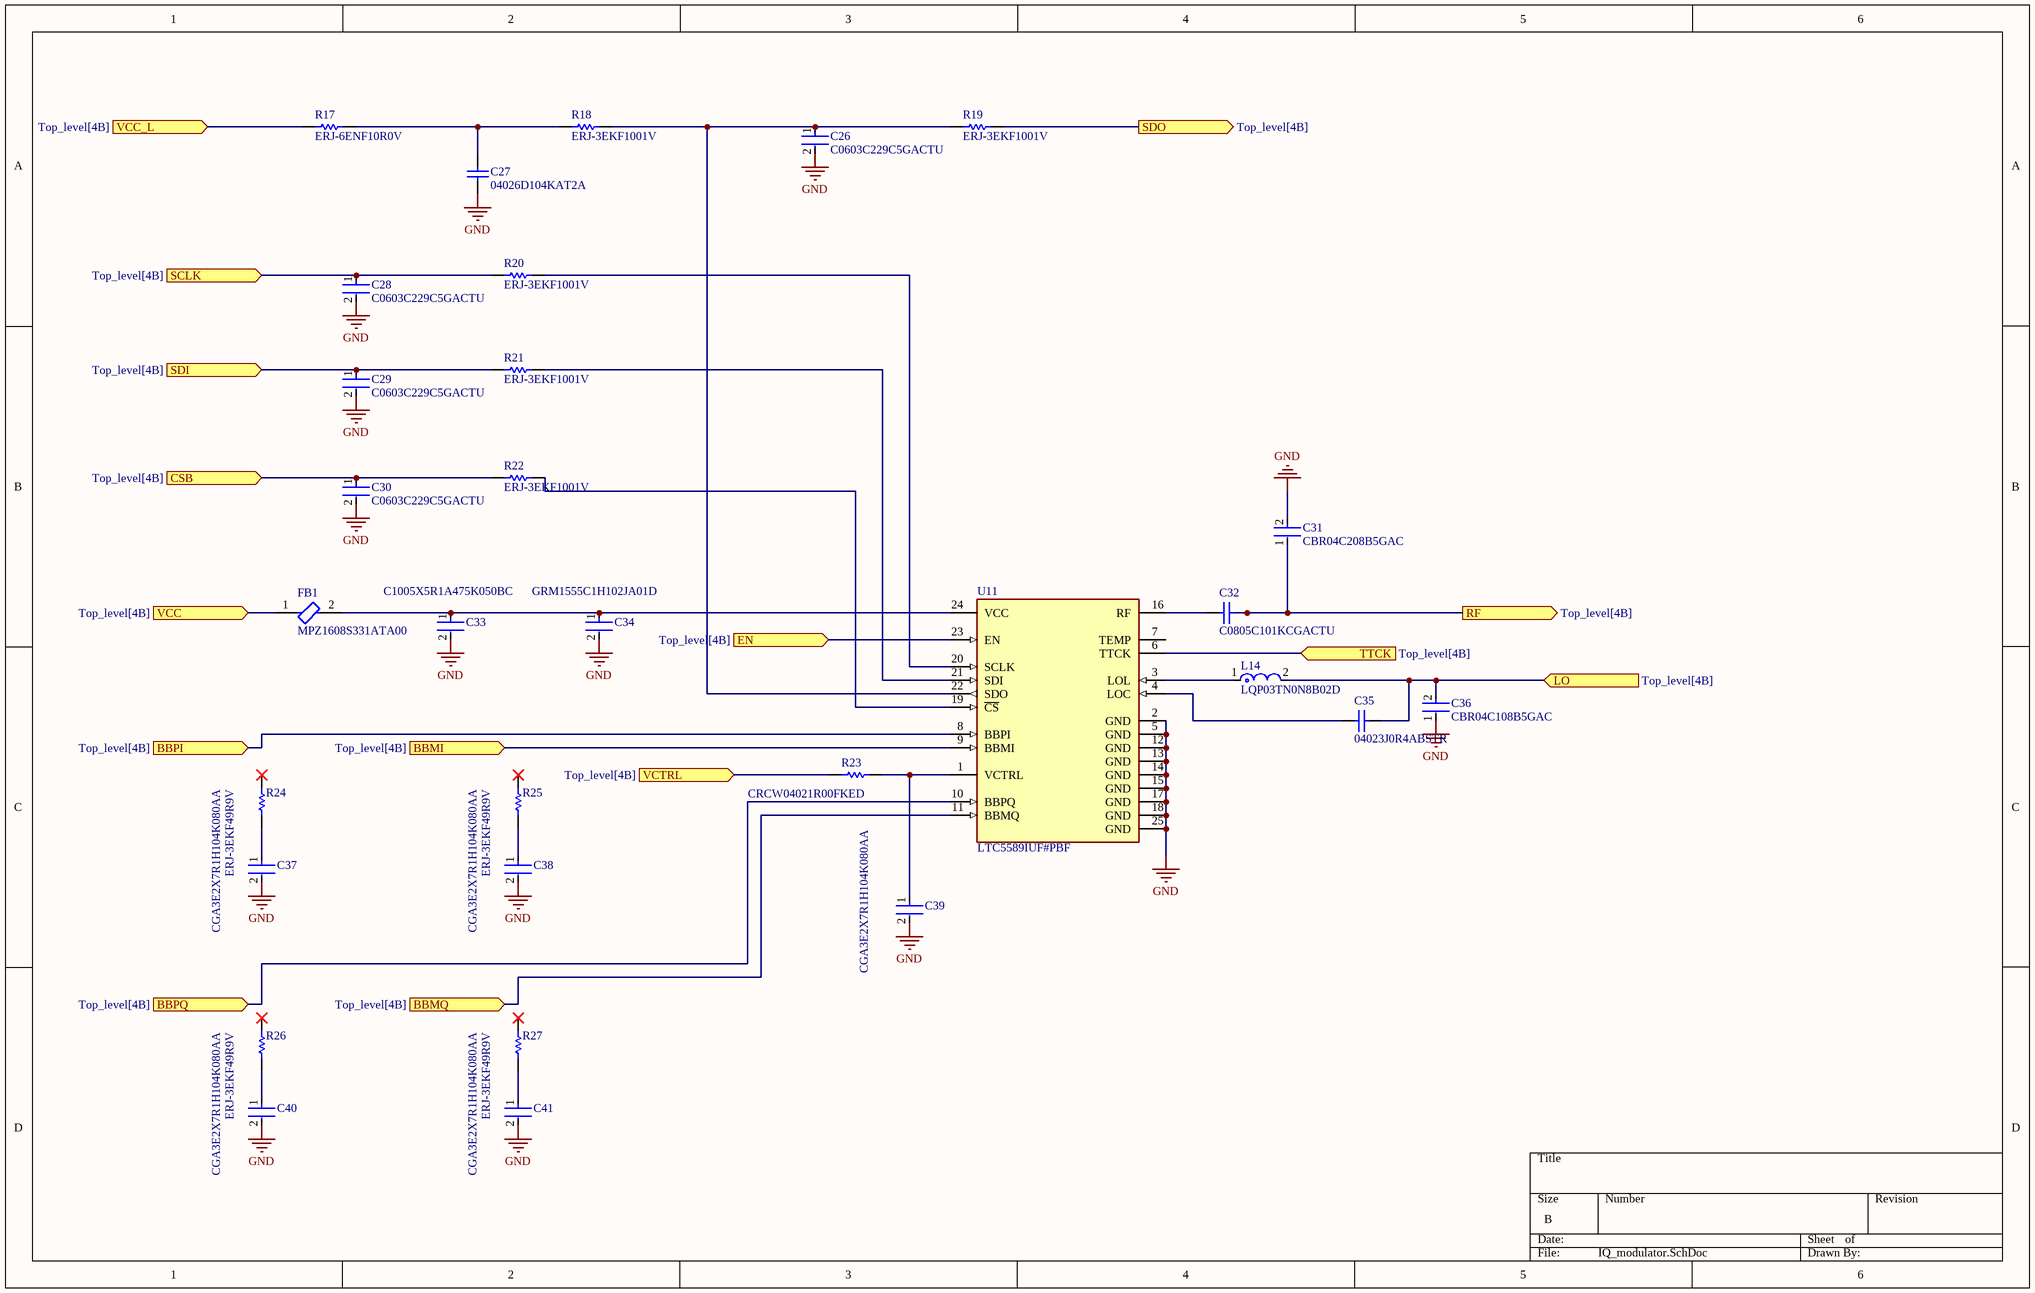
[diagram p7: IQ_modulator.SchDoc]

### Parts
C26  C0603C229C5GACTU  [FP-C0603C-CF-MFG]
C27  04026D104KAT2A  [CAPC1005X56X25LL10T15]
C28  C0603C229C5GACTU  [FP-C0603C-CF-MFG]
C29  C0603C229C5GACTU  [FP-C0603C-CF-MFG]
C30  C0603C229C5GACTU  [FP-C0603C-CF-MFG]
C31  CBR04C208B5GAC  [FP-CBR04C-MFG]
C32  C0805C101KCGACTU  [CAPC2013X140X50NL20T25]
C33  C1005X5R1A475K050BC  [FP-C1005-050-0_15-MFG]
C34  GRM1555C1H102JA01D  [FP-GRM155-0_05-IPC_B]
C35  04023J0R4ABSTR  [CAPC1006X50X20LL10T10]
C36  CBR04C108B5GAC  [FP-CBR04C-MFG]
C37  CGA3E2X7R1H104K080AA  [FP-CGA3E-0_3-0_1-IPC_A]
C38  CGA3E2X7R1H104K080AA  [FP-CGA3E-0_3-0_1-IPC_A]
C39  CGA3E2X7R1H104K080AA  [FP-CGA3E-0_3-0_1-IPC_A]
C40  CGA3E2X7R1H104K080AA  [FP-CGA3E-0_3-0_1-IPC_A]
C41  CGA3E2X7R1H104K080AA  [FP-CGA3E-0_3-0_1-IPC_A]
FB1  MPZ1608S331ATA00  [FP-MPZ1608-0_8-IPC_C]
L14  LQP03TN0N8B02D  [FP-LQP03TG_02-MFG]
R17  ERJ-6ENF10R0V  [RESC2013X70X40NL20T20]
R18  ERJ-3EKF1001V  [RESC1608X55X30LL15T15]
R19  ERJ-3EKF1001V  [RESC1608X55X30LL15T15]
R20  ERJ-3EKF1001V  [RESC1608X55X30LL15T15]
R21  ERJ-3EKF1001V  [RESC1608X55X30LL15T15]
R22  ERJ-3EKF1001V  [RESC1608X55X30LL15T15]
R23  CRCW04021R00FKED  [RESC1005X40X25ML05T05]
R24  ERJ-3EKF49R9V  [RESC1608X55X30ML15T15]
R25  ERJ-3EKF49R9V  [RESC1608X55X30ML15T15]
R26  ERJ-3EKF49R9V  [RESC1608X55X30ML15T15]
R27  ERJ-3EKF49R9V  [RESC1608X55X30ML15T15]
U11  LTC5589IUF#PBF  [FP-UF-24-05-08-1697-MFG]

### Ports
BBMI (in, see Top_level[4B]), BBMQ (in, see Top_level[4B]), BBPI (in, see Top_level[4B]), BBPQ (in, see Top_level[4B]), CSB (in, see Top_level[4B]), EN (in, see Top_level[4B]), LO (in, see Top_level[4B]), RF (out, see Top_level[4B]), SCLK (in, see Top_level[4B]), SDI (in, see Top_level[4B]), SDO (out, see Top_level[4B]), TTCK (in, see Top_level[4B]), VCC (in, see Top_level[4B]), VCC_L (in, see Top_level[4B]), VCTRL (in, see Top_level[4B])

### Nets
GND: C26.2 C27.1 C28.2 C29.2 C30.2 C31.2 C33.2 C34.2 C36.1 C37.2 C38.2 C39.2 C40.2 C41.2 U11.2(GND) U11.5(GND) U11.12(GND) U11.13(GND) U11.14(GND) U11.15(GND) U11.17(GND) U11.18(GND) U11.25(GND)
NetC17_I_BB_1: U11.8(BBPI) ; port BBPI
NetC17_I_BB_2: U11.9(BBMI) ; port BBMI
NetC17_Q_BB_1: U11.10(BBPQ) ; port BBPQ
NetC17_Q_BB_2: U11.11(BBMQ) ; port BBMQ
NetC26_1: C26.1 R18.2 R19.1 U11.22(SDO)
NetC27_2: C27.2 R17.2 R18.1
NetC28_1: C28.1 R20.1 ; port SCLK
NetC29_1: C29.1 R21.1 ; port SDI
NetC30_1: C30.1 R22.1 ; port CSB
NetC31_1: C31.1 C32.2 ; port RF
NetC32_1: C32.1 U11.16(RF)
NetC33_1: C33.1 C34.1 FB1.2 U11.24(VCC)
NetC35_1: C35.1 U11.4(LOC)
NetC35_2: C35.2 C36.2 L14.2 ; port LO
NetC37_1: C37.1 R24.1
NetC38_1: C38.1 R25.1
NetC39_1: C39.1 R23.2 U11.1(VCTRL)
NetC40_1: C40.1 R26.1
NetC41_1: C41.1 R27.1
NetFB1_1: FB1.1 ; port VCC
NetL14_1: L14.1 U11.3(LOL)
NetR17_1: R17.1 ; port VCC_L
NetR19_2: R19.2 ; port SDO
NetR20_2: R20.2 U11.20(SCLK)
NetR21_2: R21.2 U11.21(SDI)
NetR22_2: R22.2 U11.19(~{CS})
NetR23_1: R23.1 ; port VCTRL
NetU11_6: U11.6(TTCK) ; port TTCK
NetU11_23: U11.23(EN) ; port EN

Not connected (* = marked no-connect by the designer): R24 2*; R25 2*; R26 2*; R27 2*; U11 7(TEMP)

### Library data of the parts
C26 C28-C30 = CMP-1035-00158-3: CAP CER 2.2PF 50V NP0 0603; Manufacturer: KEMET; Automotive Grade: Grade 1; Temperature Coefficient: 30ppm/°C; Temperature Characteristic: C0G; Tolerance: 0.25 pF; Material: Ceramic; Lead Free: Yes; Value: 2.2 pF; Voltage Rating: 50 V; Package: C0603C-CF; Category: Cap; RoHS: TRUE; ComponentLink2Description: Datasheet; Capacitance: 2.2 pF; Device Class L2: Capacitors; Digikey Description: CAP CER 2.2PF 50V NP0 0603; Temperature: -55°C to +125°C; Temperature Range Low: -55°C; Mouser Description: Multilayer Ceramic Capacitors MLCC - SMD/SMT 50volts 2.2pF C0G 0.25%; ComponentLink2URL: https://api.kemet.com/component-edge/download/datasheet/C0603C100J5GACAUTO.pdf; Temperature Range High: +125°C; Height: 0.87mm; Manufacturer Part Number: C0603C229C5GACTU; Automotive: Yes; Device Class L1: Passive Components; Octopart: https://octopart.com/c0603c229c5gactu-kemet-3874912; Device Class L3: Ceramic Capacitors
C27 = CMP-2008-02743-1: Manufacturer: AVX Interconnect / Elco; Part Number: 04026D104KAT2A
C31 = CMP-2008-00010-2: CAP CER 0.2PF 50V C0G/NP0 0402; Manufacturer: KEMET; Tolerance: 0.1 pF; Temperature Characteristic: C0G; Material: Ceramic; Temperature Coefficient: 30ppm/°C; Package: CBR04C; Temperature: -55°C to +125°C; Capacitance: 0.2 pF; Device Class L1: Passive Components; Automotive: No; Digikey Description: CAP CER 0.2PF 50V C0G/NP0 0402; Temperature Range Low: -55°C; Device Class L2: Capacitors; Octopart: https://octopart.com/cbr04c208b5gac-kemet-20446743; Height: 0.55mm; Ipc Land Pattern Name: CAPC10050X50; Manufacturer Part Number: CBR04C208B5GAC; Temperature Range High: +125°C; Voltage Rating: 50 V; Category: Cap; Lead Free: Yes; Value: 0.2 pF; ComponentLink2URL: https://content.kemet.com/datasheets/KEM_C1030_CBR_SMD.pdf; Device Class L3: Ceramic Capacitors; ComponentLink2Description: Datasheet; RoHS: TRUE; Mouser Description: Multilayer Ceramic Capacitors MLCC - SMD/SMT 50volts .2pF C0G 0402 .1pF Tol RF
C32 = CMP-2007-03324-1: Manufacturer: Kemet; Part Number: C0805C101KCGACTU
C33 = CMP-2000-05997-2: CAP CER 4.7UF 10V X5R 0402; Dielectric Material: Ceramic; Tolerance: 10%; Series: C; Package Quantity: 10000; Max Operating Temperature: 85°C; Case Code (Imperial): 0402; Lead Free: Lead Free; Voltage Rating (DC): 10V; Packaging: Cut Tape; Voltage Rating: 10V; Min Operating Temperature: -55°C; Dielectric: X5R; Thickness: 0.022inch; Width: 0.02inch; Case/Package: 0402; Case Code (Metric): 1005; Capacitance: 4.7uF; Length: 0.039inch; RoHS Compliant: Yes; REACH SVHC: No SVHC; Mount: Surface Mount
C34 = CMP-2008-04254-2: Chip Multilayer Ceramic Capacitors for General Purpose, 0402, 1000pF, C0G, 30ppm/°C, 5%, 50V; Insulation Resistance: 10GR; Capacitance: 1nF; Packaging: Tape and Reel; Lead Free: Lead Free; Tolerance: 5%; Temperature Coefficient: 30ppm/°C; Thickness: 0.022inch; Termination: SMD/SMT; Max Operating Temperature: 125°C; Height: 0.5mm; Package Quantity: 1; Radiation Hardening: No; Material: Ceramic; Case Code (Metric): 1005; Number of Pins: 2; Voltage Rating: 50V; Mount: Surface Mount; Voltage: 50V; Case/Package: 0402; Min Operating Temperature: -55°C; Dielectric Material: Ceramic; Width: 0.5mm; Depth: 0.5mm; Case Code (Imperial): 0402; REACH SVHC: No SVHC; Dielectric: C0G; Voltage Rating (DC): 50V; Length: 1mm
C35 = CMP-2008-04709-1: Manufacturer: AVX Interconnect / Elco; Part Number: 04023J0R4ABSTR
C36 = CMP-2008-00002-2: CAP CER 0.1PF 50V C0G/NP0 0402; Manufacturer: KEMET; Temperature Characteristic: C0G; Temperature Coefficient: 30ppm/°C; Material: Ceramic; Value: 0.1 pF; RoHS: TRUE; Mouser Description: Cap Ceramic 0.1pF 50V C0G 0.1pF SMD 0402 125°C Punched Paper T/R; Ipc Land Pattern Name: CAPC10050X50; Temperature Range High: +125°C; Lead Free: Yes; Device Class L1: Passive Components; Octopart: https://octopart.com/cbr04c108b5gac-kemet-20446735; Tolerance: 0.1 pF; Height: 0.55mm; Temperature: -55°C to +125°C; ComponentLink2Description: Datasheet; Voltage Rating: 50 V; Device Class L2: Capacitors; Temperature Range Low: -55°C; Category: Cap; Package: CBR04C; Automotive: No; Device Class L3: Ceramic Capacitors; Digikey Description: CAP CER 0.1PF 50V C0G/NP0 0402; ComponentLink2URL: https://content.kemet.com/datasheets/KEM_C1030_CBR_SMD.pdf; Capacitance: 0.1 pF; Manufacturer Part Number: CBR04C108B5GAC
C37-C41 = CMP-2000-07546-2: Cap Ceramic 100nF 50V X7R 10% Pad SMD 0603 +125°C Automotive T/R; Weight: 7.1E-05oz; Composition: Ceramic; Max Operating Temperature: 125°C; Termination: SMD/SMT; Dielectric: X7R; Length: 1.6mm; Package Quantity: 1; REACH SVHC: No SVHC; Lead Free: Lead Free; Case Code (Metric): 1608; Min Operating Temperature: -55°C; Packaging: Tape and Reel; Tolerance: 10%; Voltage Rating: 50V; Case Code (Imperial): 0603; Capacitance: 100nF; Case/Package: 0603; Voltage Rating (DC): 50V; Depth: 0.8mm; Radiation Hardening: No; Ratings: AEC-Q200; Mount: Surface Mount; Voltage: 50V; Thickness: 0.035inch; Width: 0.8mm; Height: 0.8mm
FB1 = CMP-08257-000202-1: Power line Ferrite Bead 330Ω @ 100MHz 1.7A DCR 0.08Ω SMD 0603; Impedance: 330R; DC Resistance (DCR): 80mR; Tolerance: 25%; Mount: Surface Mount; Current Rating: 1.7A; Case Code (Metric): 1608; REACH SVHC: No SVHC; Package Quantity: 1; Core Material: Ferrite; Lead Free: Lead Free; Case Code (Imperial): 0603; Max DC Current: 1.7A; Length: 0.063inch; Height: 0.037inch; RoHS Compliant: Yes; Width: 0.031inch; Packaging: Tape and Reel; Case/Package: 0603
L14 = CMP-06042-004201-1: Film type RF Inductor 0.8nH ±0.1nH 800mA 0.08Ω 0201 (0603); DC Resistance (DCR): 80mR; Self Resonant Frequency: 6GHz; Shielding: Unshielded; Core Material: Non-Magnetic; Current: 600mA; Q Factor: 14; Test Frequency: 500MHz; Case/Package: 0201; Packaging: Tape and Reel; Inductance: 0.8nH; Max Operating Temperature: 125°C; Depth: 0.33mm; Width: 0.012inch; Case Code (Metric): 0603; Min Operating Temperature: -55°C; Resistor Type: Thin Film; Military Standard: Not; Max DC Current: 800mA; Height: 0.3mm; Current Rating: 800mA; Length: 0.024inch; Height - Seated (Max): 0.013inch; Package Quantity: 15000; Termination: SMD/SMT; Radiation Hardening: No; Mount: Surface Mount; DC Current: 800mA; Case Code (Imperial): 0201
R17 = CMP-1013-00284-2: Manufacturer: Panasonic; Part Number: ERJ-6ENF10R0V
R18-R22 = CMP-2000-00180-1: Manufacturer: Panasonic; Part Number: ERJ-3EKF1001V
R23 = CMP-2002-08342-1: Manufacturer: Vishay Dale; Part Number: CRCW04021R00FKED
R24-R27 = CMP-2000-00538-1: Manufacturer: Panasonic; Part Number: ERJ-3EKF49R9V
U11 = CMP-09141-000283-1: RF MODULATOR 700MHZ-6GHZ 24WFQFN; Max Frequency: 6GHz; Max Supply Voltage: 3.6V; Min Frequency: 700MHz; Min Supply Voltage: 2.7V; Case/Package: QFN; Number of Pins: 24; Min Operating Temperature: -40°C; Max Operating Temperature: 105°C; RoHS Compliant: Yes; REACH SVHC: No SVHC

## Nets that join several sheets
GND: Top_level (U5.10), Frontend (37 pins), I_BB (11 pins), Q_BB (11 pins), Clockgen (26 pins), IQ_modulator (23 pins)
NetC17_I_BB_1: I_BB (C17_I_BB.1 C18_I_BB.1 L9_I_BB.1), IQ_modulator (U11.8)
NetC17_I_BB_2: I_BB (C17_I_BB.2 C18_I_BB.2 L13_I_BB.1), IQ_modulator (U11.9)
NetC17_Q_BB_1: Q_BB (C17_Q_BB.1 C18_Q_BB.1 L9_Q_BB.1), IQ_modulator (U11.10)
NetC17_Q_BB_2: Q_BB (C17_Q_BB.2 C18_Q_BB.2 L13_Q_BB.1), IQ_modulator (U11.11)
NetJ1_1: Top_level (J1.1), Frontend (T1.6)
NetJ2_1: Top_level (J2.1), Frontend (T1.4)
NetU5_13: Top_level (U5.13), I_BB (U9_I_BB.1)
NetU5_14: Top_level (U5.14), I_BB (U7_I_BB.1)
NetU5_15: Top_level (U5.15), Q_BB (U9_Q_BB.1)
NetU5_16: Top_level (U5.16), Q_BB (U7_Q_BB.1)